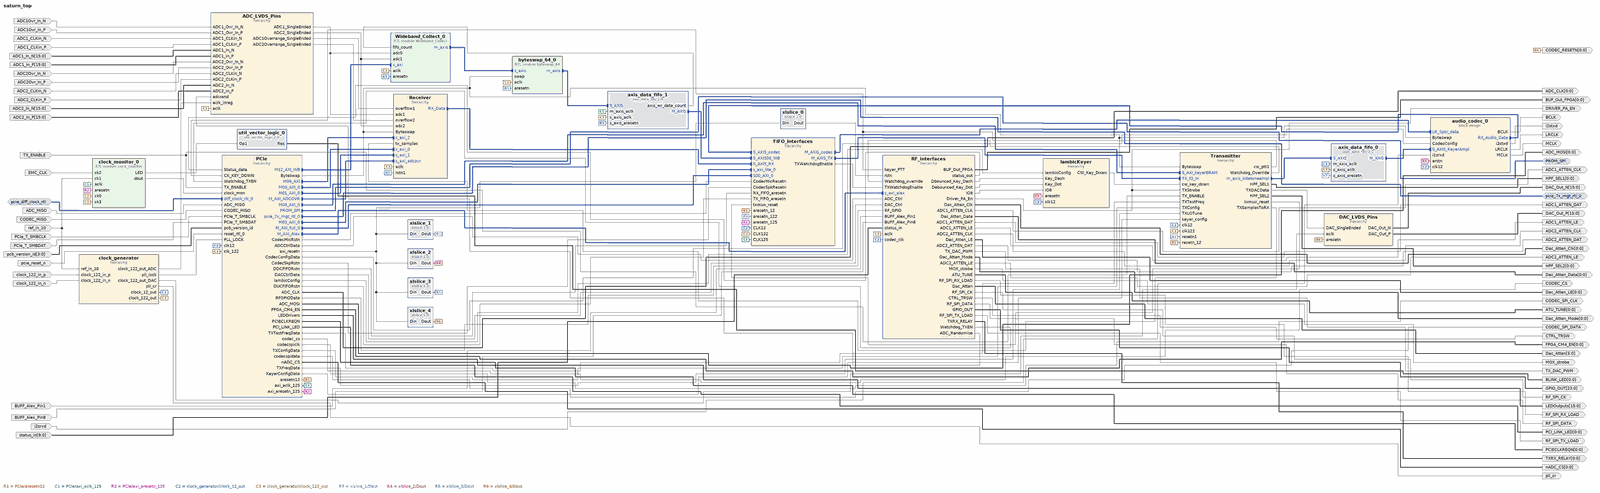
[diagram p0: block diagram of the top level, whole]
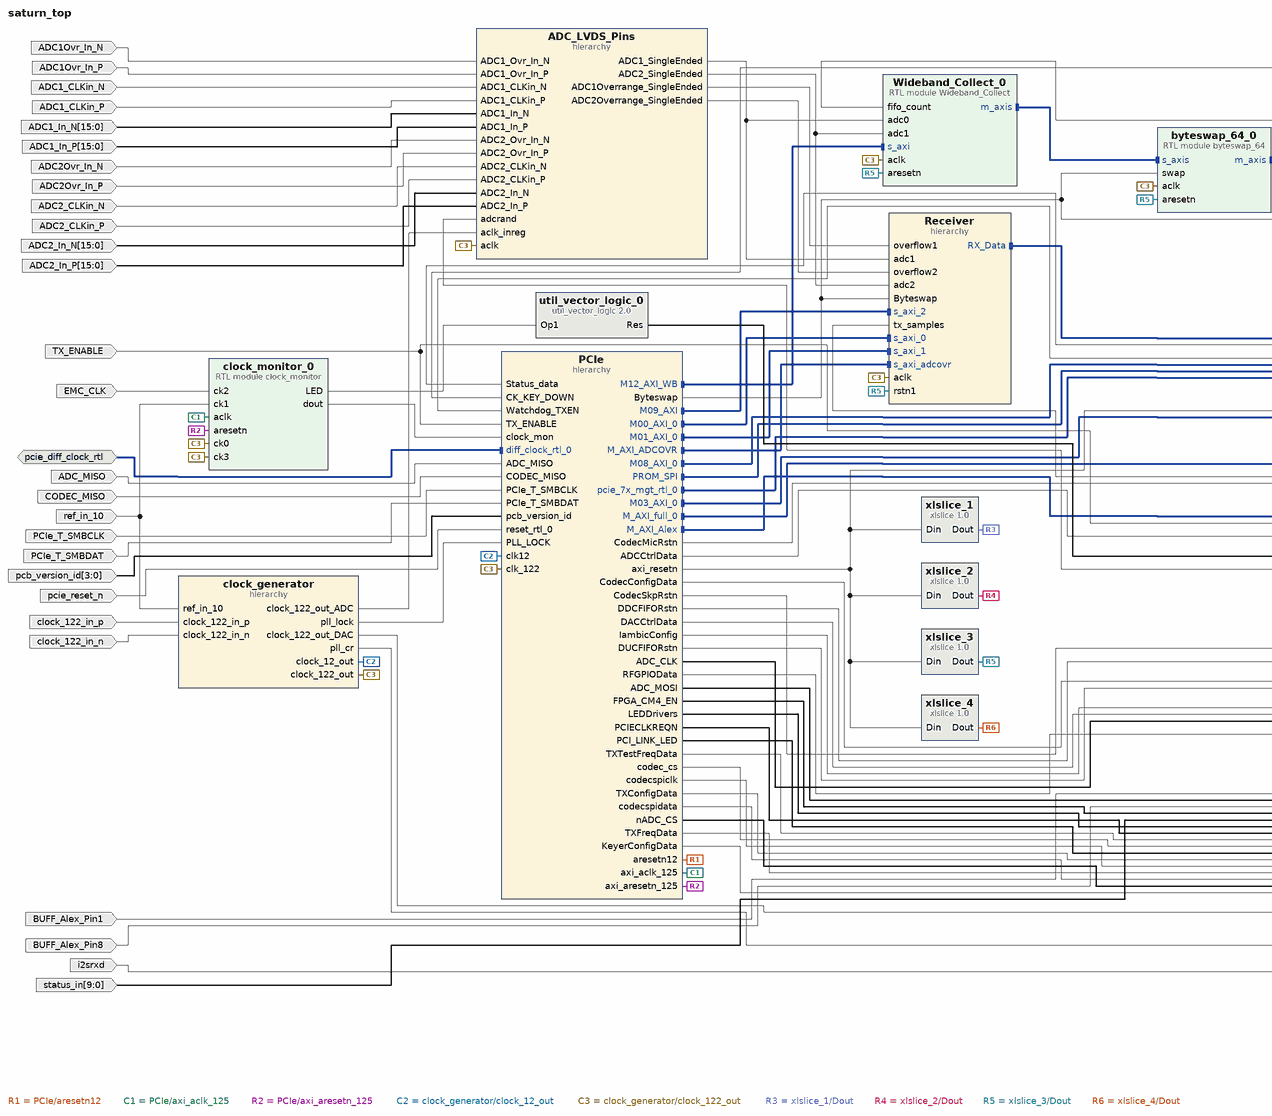
[diagram p1: block diagram of the top level, left part]
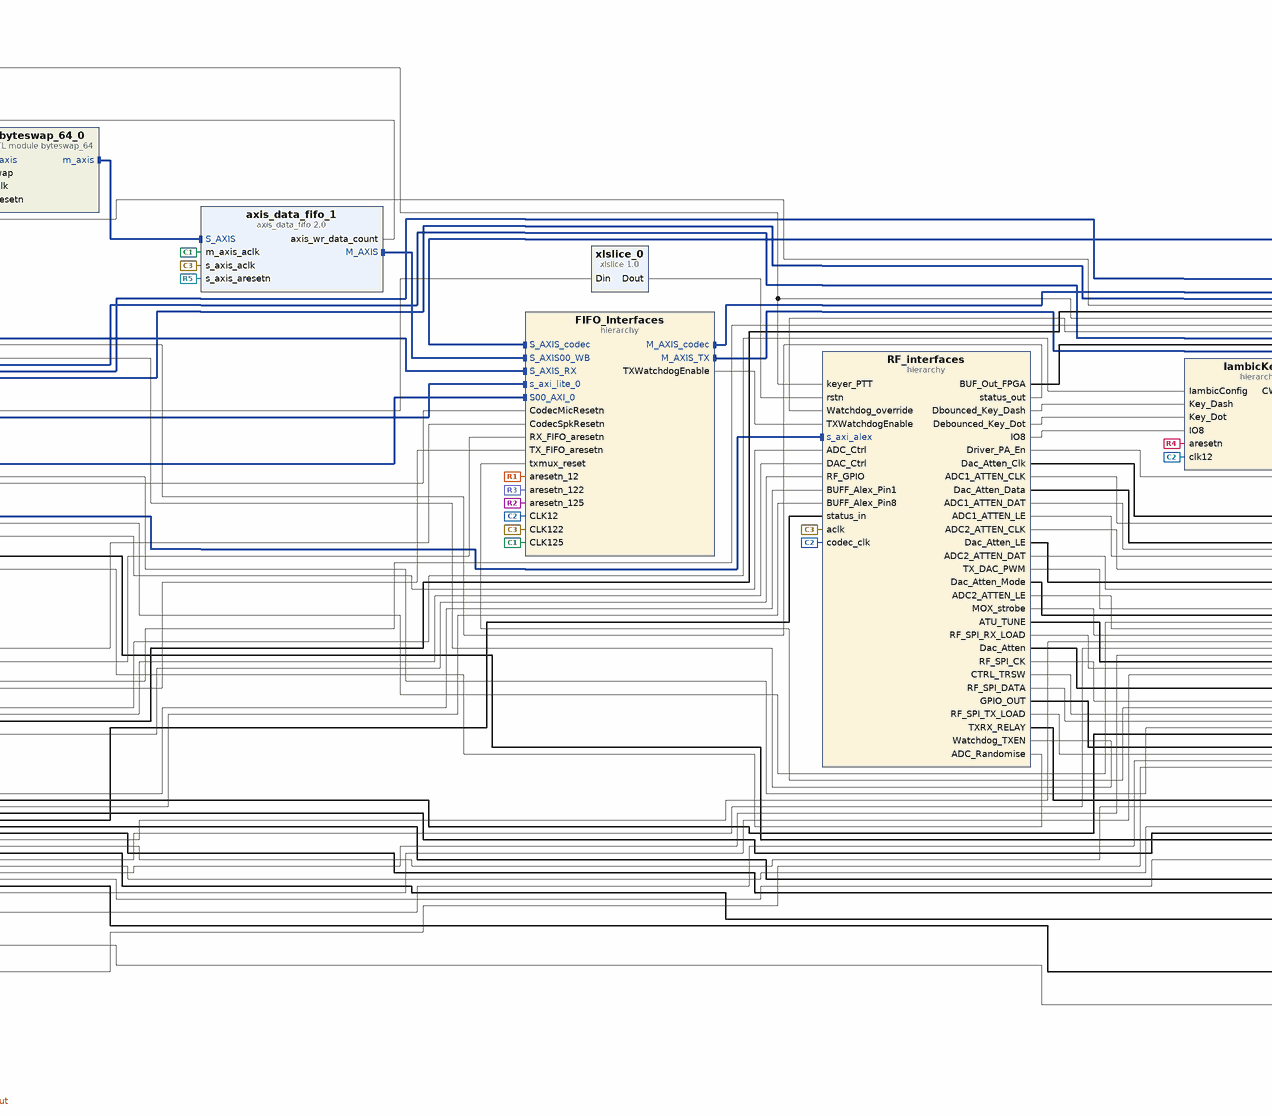
[diagram p2: block diagram of the top level, centre part]
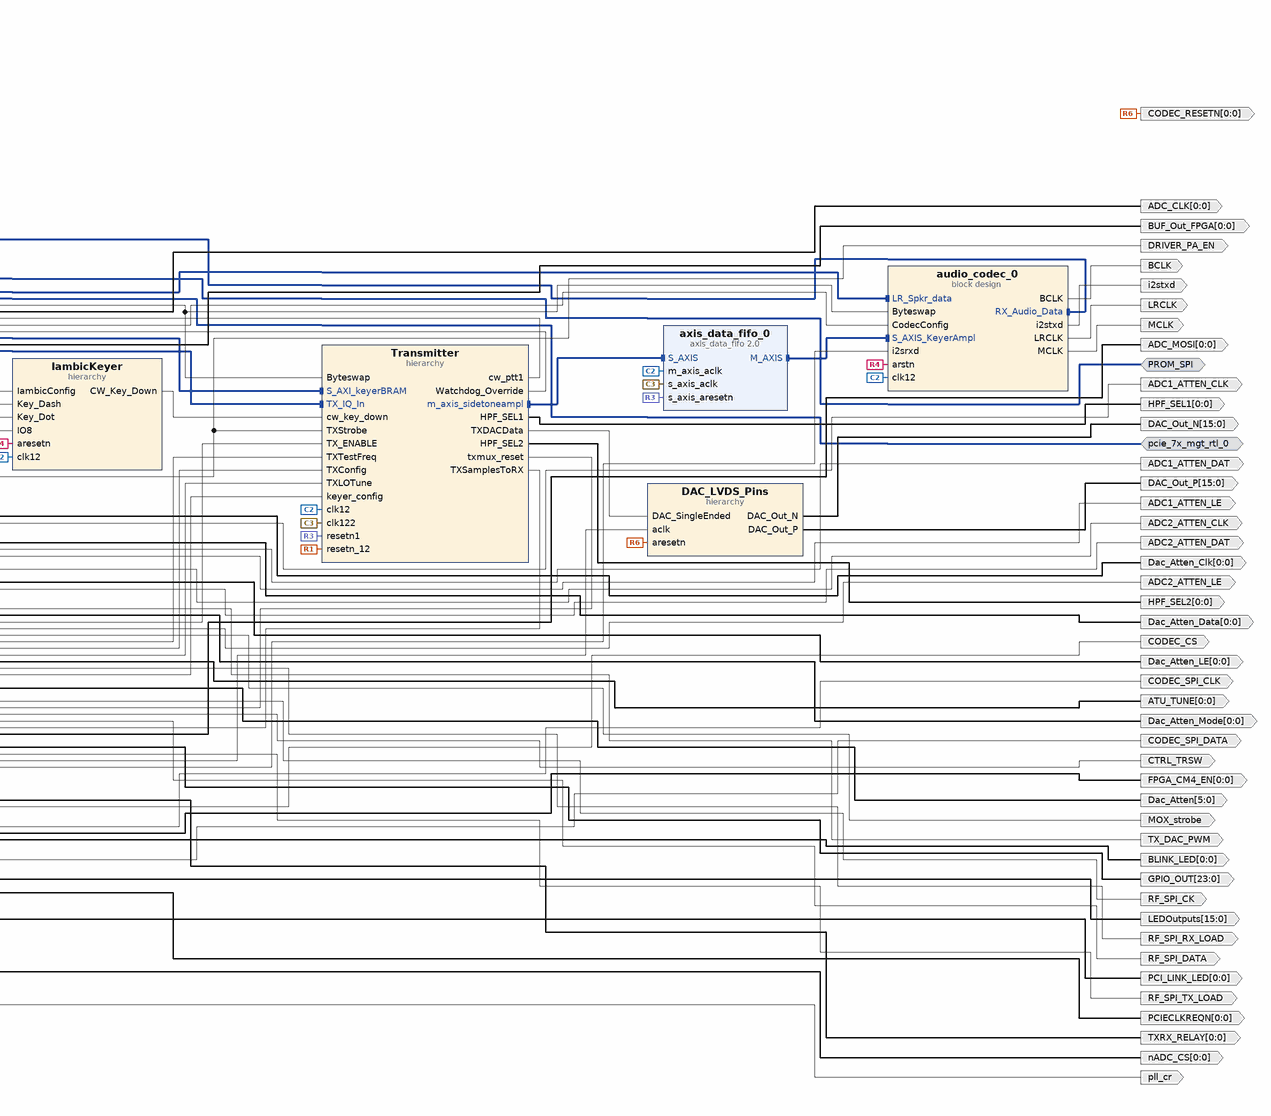
[diagram p3: block diagram of the top level, right part]
# Vivado block design saturn_top, xc7a200tfbg676-2, Vivado 2023.1
create_bd_design saturn_top

create_bd_intf_port -mode Master -vlnv xilinx.com:interface:spi_rtl:1.0 PROM_SPI
create_bd_intf_port -mode Master -vlnv xilinx.com:interface:pcie_7x_mgt_rtl:1.0 pcie_7x_mgt_rtl_0
create_bd_intf_port -mode Slave -vlnv xilinx.com:interface:diff_clock_rtl:1.0 pcie_diff_clock_rtl
set_property -dict {CONFIG.FREQ_HZ 100000000} [get_bd_intf_ports pcie_diff_clock_rtl]
create_bd_port -dir I ADC1Ovr_In_N
create_bd_port -dir I ADC1Ovr_In_P
create_bd_port -dir O ADC1_ATTEN_CLK
create_bd_port -dir O ADC1_ATTEN_DAT
create_bd_port -dir O ADC1_ATTEN_LE
create_bd_port -dir I ADC1_CLKin_N
create_bd_port -dir I ADC1_CLKin_P
create_bd_port -dir I -from 15 -to 0 ADC1_In_N
create_bd_port -dir I -from 15 -to 0 ADC1_In_P
create_bd_port -dir I ADC2Ovr_In_N
create_bd_port -dir I ADC2Ovr_In_P
create_bd_port -dir O ADC2_ATTEN_CLK
create_bd_port -dir O ADC2_ATTEN_DAT
create_bd_port -dir O ADC2_ATTEN_LE
create_bd_port -dir I ADC2_CLKin_N
create_bd_port -dir I ADC2_CLKin_P
create_bd_port -dir I -from 15 -to 0 ADC2_In_N
create_bd_port -dir I -from 15 -to 0 ADC2_In_P
create_bd_port -dir O -from 0 -to 0 ADC_CLK
create_bd_port -dir I ADC_MISO
create_bd_port -dir O -from 0 -to 0 ADC_MOSI
create_bd_port -dir O -from 0 -to 0 ATU_TUNE
create_bd_port -dir O BCLK
create_bd_port -dir O -from 0 -to 0 BLINK_LED
create_bd_port -dir I BUFF_Alex_Pin1
create_bd_port -dir I BUFF_Alex_Pin8
create_bd_port -dir O -from 0 -to 0 BUF_Out_FPGA
create_bd_port -dir O CTRL_TRSW
create_bd_port -dir O -from 15 -to 0 DAC_Out_N
create_bd_port -dir O -from 15 -to 0 DAC_Out_P
create_bd_port -dir O DRIVER_PA_EN
create_bd_port -dir O -from 5 -to 0 Dac_Atten
create_bd_port -dir O -from 0 -to 0 Dac_Atten_Clk
create_bd_port -dir O -from 0 -to 0 Dac_Atten_Data
create_bd_port -dir O -from 0 -to 0 Dac_Atten_LE
create_bd_port -dir O -from 0 -to 0 Dac_Atten_Mode
create_bd_port -dir I -type clk EMC_CLK
set_property -dict {CONFIG.FREQ_HZ 122880000} [get_bd_ports EMC_CLK]
create_bd_port -dir O -from 0 -to 0 FPGA_CM4_EN
create_bd_port -dir O -from 23 -to 0 GPIO_OUT
create_bd_port -dir O -from 15 -to 0 LEDOutputs
create_bd_port -dir O LRCLK
create_bd_port -dir O -type clk MCLK
create_bd_port -dir O MOX_strobe
create_bd_port -dir O -from 0 -to 0 PCIECLKREQN
create_bd_port -dir O -from 0 -to 0 PCI_LINK_LED
create_bd_port -dir I PCIe_T_SMBCLK
create_bd_port -dir I PCIe_T_SMBDAT
create_bd_port -dir O RF_SPI_CK
create_bd_port -dir O RF_SPI_DATA
create_bd_port -dir O RF_SPI_RX_LOAD
create_bd_port -dir O RF_SPI_TX_LOAD
create_bd_port -dir O -from 0 -to 0 TXRX_RELAY
create_bd_port -dir O TX_DAC_PWM
create_bd_port -dir I TX_ENABLE
create_bd_port -dir I clock_122_in_n
create_bd_port -dir I -type clk clock_122_in_p
set_property -dict {CONFIG.FREQ_HZ 122880000} [get_bd_ports clock_122_in_p]
create_bd_port -dir I i2srxd
create_bd_port -dir O i2stxd
create_bd_port -dir O -from 0 -to 0 nADC_CS
create_bd_port -dir I -type rst pcie_reset_n
set_property -dict {CONFIG.POLARITY ACTIVE_LOW} [get_bd_ports pcie_reset_n]
create_bd_port -dir O pll_cr
create_bd_port -dir I -from 9 -to 0 status_in
create_bd_port -dir O CODEC_SPI_DATA
create_bd_port -dir O CODEC_SPI_CLK
create_bd_port -dir O CODEC_CS
create_bd_port -dir I -from 3 -to 0 pcb_version_id
create_bd_port -dir I CODEC_MISO
create_bd_port -dir O -from 0 -to 0 CODEC_RESETN
create_bd_port -dir I -type clk ref_in_10
set_property -dict {CONFIG.FREQ_HZ 10000000} [get_bd_ports ref_in_10]
create_bd_port -dir O -from 0 -to 0 HPF_SEL1
create_bd_port -dir O -from 0 -to 0 HPF_SEL2

create_bd_cell -type hier ADC_LVDS_Pins
create_bd_cell -type hier DAC_LVDS_Pins
create_bd_cell -type hier FIFO_Interfaces
create_bd_cell -type hier PCIe
create_bd_cell -type hier RF_interfaces
create_bd_cell -type hier Receiver
create_bd_cell -type hier Transmitter
create_bd_cell -type container -reference audio_codec audio_codec_0
set_property -dict [list \
  CONFIG.ACTIVE_SIM_BD audio_codec.bd \
  CONFIG.ACTIVE_SYNTH_BD audio_codec.bd \
  CONFIG.ENABLE_DFX 0 \
  CONFIG.LIST_SIM_BD audio_codec.bd \
  CONFIG.LIST_SYNTH_BD audio_codec.bd \
  CONFIG.LOCK_PROPAGATE 0 \
] [get_bd_cells audio_codec_0]
create_bd_cell -type hier clock_generator
create_bd_cell -type ip -vlnv xilinx.com:ip:xlslice:1.0 xlslice_0
set_property -dict {CONFIG.DIN_FROM 4 CONFIG.DIN_TO 4 CONFIG.DIN_WIDTH 5 CONFIG.DOUT_WIDTH 1} [get_bd_cells xlslice_0]
create_bd_cell -type ip -vlnv xilinx.com:ip:xlslice:1.0 xlslice_1
set_property -dict {CONFIG.DIN_FROM 3 CONFIG.DIN_TO 3 CONFIG.DIN_WIDTH 5 CONFIG.DOUT_WIDTH 1} [get_bd_cells xlslice_1]
create_bd_cell -type ip -vlnv xilinx.com:ip:xlslice:1.0 xlslice_2
set_property -dict {CONFIG.DIN_FROM 2 CONFIG.DIN_TO 2 CONFIG.DIN_WIDTH 5 CONFIG.DOUT_WIDTH 1} [get_bd_cells xlslice_2]
create_bd_cell -type ip -vlnv xilinx.com:ip:xlslice:1.0 xlslice_3
set_property -dict {CONFIG.DIN_FROM 1 CONFIG.DIN_TO 1 CONFIG.DIN_WIDTH 5 CONFIG.DOUT_WIDTH 1} [get_bd_cells xlslice_3]
create_bd_cell -type ip -vlnv xilinx.com:ip:xlslice:1.0 xlslice_4
set_property -dict {CONFIG.DIN_FROM 0 CONFIG.DIN_TO 0 CONFIG.DIN_WIDTH 5 CONFIG.DOUT_WIDTH 1} [get_bd_cells xlslice_4]
create_bd_cell -type hier IambicKeyer
create_bd_cell -type ip -vlnv xilinx.com:ip:axis_data_fifo:2.0 axis_data_fifo_0
set_property -dict {CONFIG.FIFO_DEPTH 16 CONFIG.IS_ACLK_ASYNC 1} [get_bd_cells axis_data_fifo_0]
create_bd_cell -type ip -vlnv xilinx.com:ip:util_vector_logic:2.0 util_vector_logic_0
set_property -dict {CONFIG.C_OPERATION not CONFIG.C_SIZE 1} [get_bd_cells util_vector_logic_0]
create_bd_cell -type ip -vlnv xilinx.com:ip:axis_data_fifo:2.0 axis_data_fifo_1
set_property -dict [list \
  CONFIG.FIFO_DEPTH 8192 \
  CONFIG.HAS_WR_DATA_COUNT 1 \
  CONFIG.IS_ACLK_ASYNC 1 \
  CONFIG.TDATA_NUM_BYTES 8 \
] [get_bd_cells axis_data_fifo_1]
create_bd_cell -type module -reference clock_monitor clock_monitor_0
create_bd_cell -type module -reference byteswap_64 byteswap_64_0
create_bd_cell -type module -reference Wideband_Collect Wideband_Collect_0

# ---- hierarchy /ADC_LVDS_Pins ----
current_bd_instance /ADC_LVDS_Pins
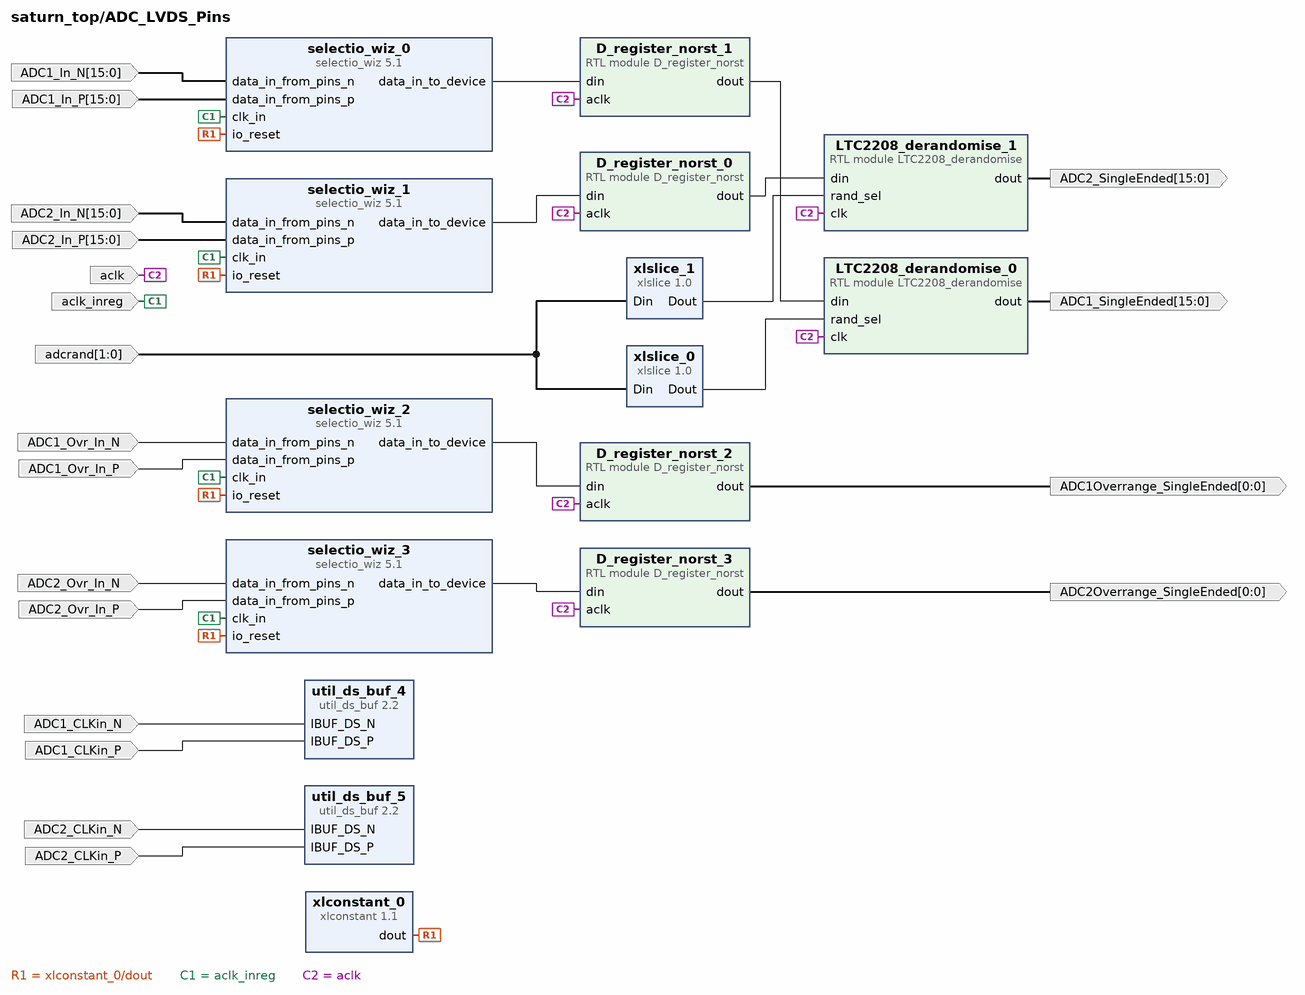
[diagram p4: block diagram inside /ADC_LVDS_Pins]
create_bd_pin -dir O -from 0 -to 0 ADC1Overrange_SingleEnded
create_bd_pin -dir I ADC1_CLKin_N
create_bd_pin -dir I ADC1_CLKin_P
create_bd_pin -dir I -from 15 -to 0 ADC1_In_N
create_bd_pin -dir I -from 15 -to 0 ADC1_In_P
create_bd_pin -dir I ADC1_Ovr_In_N
create_bd_pin -dir I ADC1_Ovr_In_P
create_bd_pin -dir O -from 15 -to 0 ADC1_SingleEnded
create_bd_pin -dir O -from 0 -to 0 ADC2Overrange_SingleEnded
create_bd_pin -dir I ADC2_CLKin_N
create_bd_pin -dir I ADC2_CLKin_P
create_bd_pin -dir I -from 15 -to 0 ADC2_In_N
create_bd_pin -dir I -from 15 -to 0 ADC2_In_P
create_bd_pin -dir I ADC2_Ovr_In_N
create_bd_pin -dir I ADC2_Ovr_In_P
create_bd_pin -dir O -from 15 -to 0 ADC2_SingleEnded
create_bd_pin -dir I aclk_inreg
create_bd_pin -dir I -from 1 -to 0 adcrand
create_bd_pin -dir I aclk

create_bd_cell -type ip -vlnv xilinx.com:ip:xlslice:1.0 xlslice_0
set_property -dict {CONFIG.DIN_FROM 0 CONFIG.DIN_TO 0 CONFIG.DIN_WIDTH 2} [get_bd_cells xlslice_0]
create_bd_cell -type ip -vlnv xilinx.com:ip:xlslice:1.0 xlslice_1
set_property -dict {CONFIG.DIN_FROM 1 CONFIG.DIN_TO 1 CONFIG.DIN_WIDTH 2 CONFIG.DOUT_WIDTH 1} [get_bd_cells xlslice_1]
create_bd_cell -type module -reference D_register_norst D_register_norst_1
create_bd_cell -type module -reference D_register_norst D_register_norst_2
set_property -dict {CONFIG.DATA_WIDTH 1} [get_bd_cells D_register_norst_2]
create_bd_cell -type module -reference D_register_norst D_register_norst_3
set_property -dict {CONFIG.DATA_WIDTH 1} [get_bd_cells D_register_norst_3]
create_bd_cell -type ip -vlnv xilinx.com:ip:selectio_wiz:5.1 selectio_wiz_0
set_property -dict [list \
  CONFIG.BUS_IO_STD LVDS_25 \
  CONFIG.BUS_SIG_TYPE DIFF \
  CONFIG.CLK_FWD_IO_STD LVDS_25 \
  CONFIG.CLK_FWD_SIG_TYPE DIFF \
  CONFIG.SELIO_CLK_BUF MMCM \
  CONFIG.SELIO_CLK_IO_STD LVDS_25 \
  CONFIG.SELIO_CLK_SIG_TYPE DIFF \
  CONFIG.SERIALIZATION_FACTOR 4 \
  CONFIG.SYSTEM_DATA_WIDTH 16 \
] [get_bd_cells selectio_wiz_0]
create_bd_cell -type ip -vlnv xilinx.com:ip:selectio_wiz:5.1 selectio_wiz_1
set_property -dict [list \
  CONFIG.BUS_IO_STD LVDS_25 \
  CONFIG.BUS_SIG_TYPE DIFF \
  CONFIG.CLK_FWD_IO_STD LVDS_25 \
  CONFIG.CLK_FWD_SIG_TYPE DIFF \
  CONFIG.SELIO_CLK_BUF MMCM \
  CONFIG.SELIO_CLK_IO_STD LVDS_25 \
  CONFIG.SELIO_CLK_SIG_TYPE DIFF \
  CONFIG.SERIALIZATION_FACTOR 4 \
  CONFIG.SYSTEM_DATA_WIDTH 16 \
] [get_bd_cells selectio_wiz_1]
create_bd_cell -type ip -vlnv xilinx.com:ip:selectio_wiz:5.1 selectio_wiz_2
set_property -dict [list \
  CONFIG.BUS_IO_STD LVDS_25 \
  CONFIG.BUS_SIG_TYPE DIFF \
  CONFIG.CLK_FWD_IO_STD LVDS_25 \
  CONFIG.CLK_FWD_SIG_TYPE DIFF \
  CONFIG.SELIO_CLK_BUF MMCM \
  CONFIG.SELIO_CLK_IO_STD LVDS_25 \
  CONFIG.SELIO_CLK_SIG_TYPE DIFF \
  CONFIG.SERIALIZATION_FACTOR 4 \
  CONFIG.SYSTEM_DATA_WIDTH 1 \
] [get_bd_cells selectio_wiz_2]
create_bd_cell -type ip -vlnv xilinx.com:ip:selectio_wiz:5.1 selectio_wiz_3
set_property -dict [list \
  CONFIG.BUS_IO_STD LVDS_25 \
  CONFIG.BUS_SIG_TYPE DIFF \
  CONFIG.CLK_FWD_IO_STD LVDS_25 \
  CONFIG.CLK_FWD_SIG_TYPE DIFF \
  CONFIG.SELIO_CLK_BUF MMCM \
  CONFIG.SELIO_CLK_IO_STD LVDS_25 \
  CONFIG.SELIO_CLK_SIG_TYPE DIFF \
  CONFIG.SERIALIZATION_FACTOR 4 \
  CONFIG.SYSTEM_DATA_WIDTH 1 \
] [get_bd_cells selectio_wiz_3]
create_bd_cell -type ip -vlnv xilinx.com:ip:util_ds_buf:2.2 util_ds_buf_4
set_property -dict {CONFIG.C_BUF_TYPE IBUFDS} [get_bd_cells util_ds_buf_4]
create_bd_cell -type ip -vlnv xilinx.com:ip:util_ds_buf:2.2 util_ds_buf_5
set_property -dict {CONFIG.C_BUF_TYPE IBUFDS} [get_bd_cells util_ds_buf_5]
create_bd_cell -type ip -vlnv xilinx.com:ip:xlconstant:1.1 xlconstant_0
set_property -dict {CONFIG.CONST_VAL 0} [get_bd_cells xlconstant_0]
create_bd_cell -type module -reference LTC2208_derandomise LTC2208_derandomise_1
create_bd_cell -type module -reference D_register_norst D_register_norst_0
create_bd_cell -type module -reference LTC2208_derandomise LTC2208_derandomise_0

# ---- hierarchy /DAC_LVDS_Pins ----
current_bd_instance /DAC_LVDS_Pins
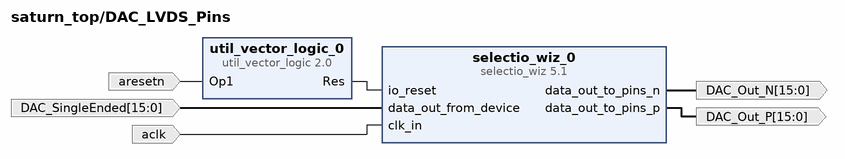
[diagram p5: block diagram inside /DAC_LVDS_Pins]
create_bd_pin -dir O -from 15 -to 0 DAC_Out_N
create_bd_pin -dir O -from 15 -to 0 DAC_Out_P
create_bd_pin -dir I -from 15 -to 0 DAC_SingleEnded
create_bd_pin -dir I aresetn
create_bd_pin -dir I aclk

create_bd_cell -type ip -vlnv xilinx.com:ip:selectio_wiz:5.1 selectio_wiz_0
set_property -dict [list \
  CONFIG.BUS_DIR OUTPUTS \
  CONFIG.BUS_IO_STD LVDS_25 \
  CONFIG.BUS_SIG_TYPE DIFF \
  CONFIG.CLK_FWD_IO_STD LVDS_25 \
  CONFIG.CLK_FWD_SIG_TYPE DIFF \
  CONFIG.SELIO_BUS_IN_DELAY NONE \
  CONFIG.SELIO_CLK_BUF MMCM \
  CONFIG.SELIO_CLK_IO_STD LVDS_25 \
  CONFIG.SELIO_CLK_SIG_TYPE DIFF \
  CONFIG.SELIO_INTERFACE_TYPE NETWORKING \
  CONFIG.SERIALIZATION_FACTOR 4 \
  CONFIG.SYSTEM_DATA_WIDTH 16 \
] [get_bd_cells selectio_wiz_0]
create_bd_cell -type ip -vlnv xilinx.com:ip:util_vector_logic:2.0 util_vector_logic_0
set_property -dict {CONFIG.C_OPERATION not CONFIG.C_SIZE 1} [get_bd_cells util_vector_logic_0]

# ---- hierarchy /FIFO_Interfaces ----
current_bd_instance /FIFO_Interfaces
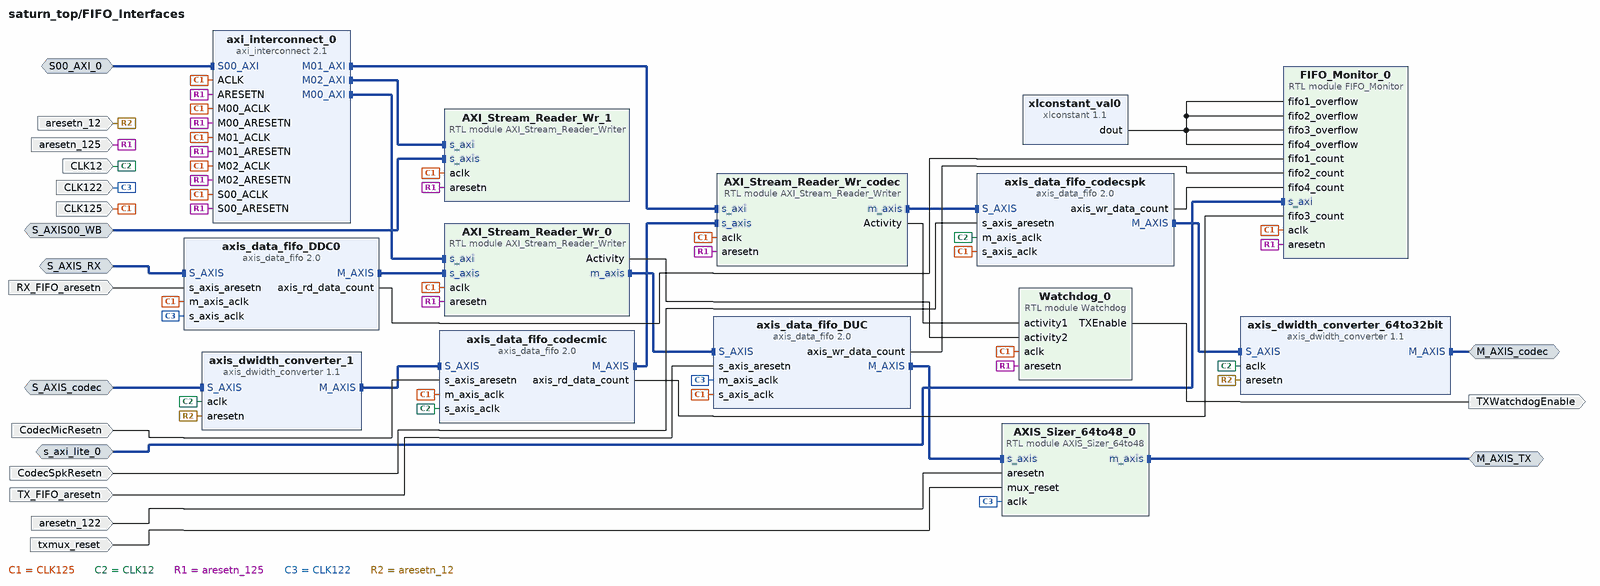
[diagram p6: block diagram inside /FIFO_Interfaces]
create_bd_intf_pin -mode Master -vlnv xilinx.com:interface:axis_rtl:1.0 M_AXIS_TX
create_bd_intf_pin -mode Master -vlnv xilinx.com:interface:axis_rtl:1.0 M_AXIS_codec
create_bd_intf_pin -mode Slave -vlnv xilinx.com:interface:aximm_rtl:1.0 S00_AXI_0
create_bd_intf_pin -mode Slave -vlnv xilinx.com:interface:axis_rtl:1.0 S_AXIS_RX
create_bd_intf_pin -mode Slave -vlnv xilinx.com:interface:axis_rtl:1.0 S_AXIS_codec
create_bd_intf_pin -mode Slave -vlnv xilinx.com:interface:aximm_rtl:1.0 s_axi_lite_0
create_bd_intf_pin -mode Slave -vlnv xilinx.com:interface:axis_rtl:1.0 S_AXIS00_WB
create_bd_pin -dir I CLK12
create_bd_pin -dir I CLK122
create_bd_pin -dir I CLK125
create_bd_pin -dir I aresetn_12
create_bd_pin -dir I aresetn_125
create_bd_pin -dir I TX_FIFO_aresetn
create_bd_pin -dir I RX_FIFO_aresetn
create_bd_pin -dir I CodecMicResetn
create_bd_pin -dir I CodecSpkResetn
create_bd_pin -dir I aresetn_122
create_bd_pin -dir I txmux_reset
create_bd_pin -dir O TXWatchdogEnable

create_bd_cell -type ip -vlnv xilinx.com:ip:axi_interconnect:2.1 axi_interconnect_0
set_property -dict {CONFIG.NUM_MI 3} [get_bd_cells axi_interconnect_0]
create_bd_cell -type ip -vlnv xilinx.com:ip:axis_data_fifo:2.0 axis_data_fifo_DDC0
set_property -dict [list \
  CONFIG.FIFO_DEPTH 16384 \
  CONFIG.HAS_AFULL 0 \
  CONFIG.HAS_RD_DATA_COUNT 1 \
  CONFIG.HAS_WR_DATA_COUNT 0 \
  CONFIG.IS_ACLK_ASYNC 1 \
  CONFIG.TDATA_NUM_BYTES 8 \
] [get_bd_cells axis_data_fifo_DDC0]
create_bd_cell -type ip -vlnv xilinx.com:ip:axis_data_fifo:2.0 axis_data_fifo_DUC
set_property -dict [list \
  CONFIG.FIFO_DEPTH 4096 \
  CONFIG.HAS_WR_DATA_COUNT 1 \
  CONFIG.IS_ACLK_ASYNC 1 \
  CONFIG.TDATA_NUM_BYTES 8 \
] [get_bd_cells axis_data_fifo_DUC]
create_bd_cell -type ip -vlnv xilinx.com:ip:axis_data_fifo:2.0 axis_data_fifo_codecmic
set_property -dict [list \
  CONFIG.FIFO_DEPTH 256 \
  CONFIG.HAS_RD_DATA_COUNT 1 \
  CONFIG.IS_ACLK_ASYNC 1 \
  CONFIG.TDATA_NUM_BYTES 8 \
] [get_bd_cells axis_data_fifo_codecmic]
create_bd_cell -type ip -vlnv xilinx.com:ip:axis_data_fifo:2.0 axis_data_fifo_codecspk
set_property -dict [list \
  CONFIG.FIFO_DEPTH 1024 \
  CONFIG.HAS_WR_DATA_COUNT 1 \
  CONFIG.IS_ACLK_ASYNC 1 \
  CONFIG.TDATA_NUM_BYTES 8 \
] [get_bd_cells axis_data_fifo_codecspk]
create_bd_cell -type ip -vlnv xilinx.com:ip:axis_dwidth_converter:1.1 axis_dwidth_converter_1
set_property -dict {CONFIG.M_TDATA_NUM_BYTES 8 CONFIG.S_TDATA_NUM_BYTES 2} [get_bd_cells axis_dwidth_converter_1]
create_bd_cell -type ip -vlnv xilinx.com:ip:axis_dwidth_converter:1.1 axis_dwidth_converter_64to32bit
set_property -dict {CONFIG.M_TDATA_NUM_BYTES 4 CONFIG.S_TDATA_NUM_BYTES 8} [get_bd_cells axis_dwidth_converter_64to32bit]
create_bd_cell -type ip -vlnv xilinx.com:ip:xlconstant:1.1 xlconstant_val0
set_property -dict {CONFIG.CONST_VAL 0} [get_bd_cells xlconstant_val0]
create_bd_cell -type module -reference AXI_Stream_Reader_Writer AXI_Stream_Reader_Wr_1
set_property -dict {CONFIG.AXI_DATA_WIDTH 64} [get_bd_cells AXI_Stream_Reader_Wr_1]
create_bd_cell -type module -reference AXI_Stream_Reader_Writer AXI_Stream_Reader_Wr_codec
set_property -dict {CONFIG.AXI_DATA_WIDTH 64} [get_bd_cells AXI_Stream_Reader_Wr_codec]
create_bd_cell -type module -reference AXIS_Sizer_64to48 AXIS_Sizer_64to48_0
create_bd_cell -type module -reference FIFO_Monitor FIFO_Monitor_0
create_bd_cell -type module -reference AXI_Stream_Reader_Writer AXI_Stream_Reader_Wr_0
set_property -dict {CONFIG.AXI_DATA_WIDTH 64} [get_bd_cells AXI_Stream_Reader_Wr_0]
create_bd_cell -type module -reference Watchdog Watchdog_0
set_property -dict {CONFIG.TimeoutClocks 245760000} [get_bd_cells Watchdog_0]

# ---- hierarchy /PCIe ----
current_bd_instance /PCIe
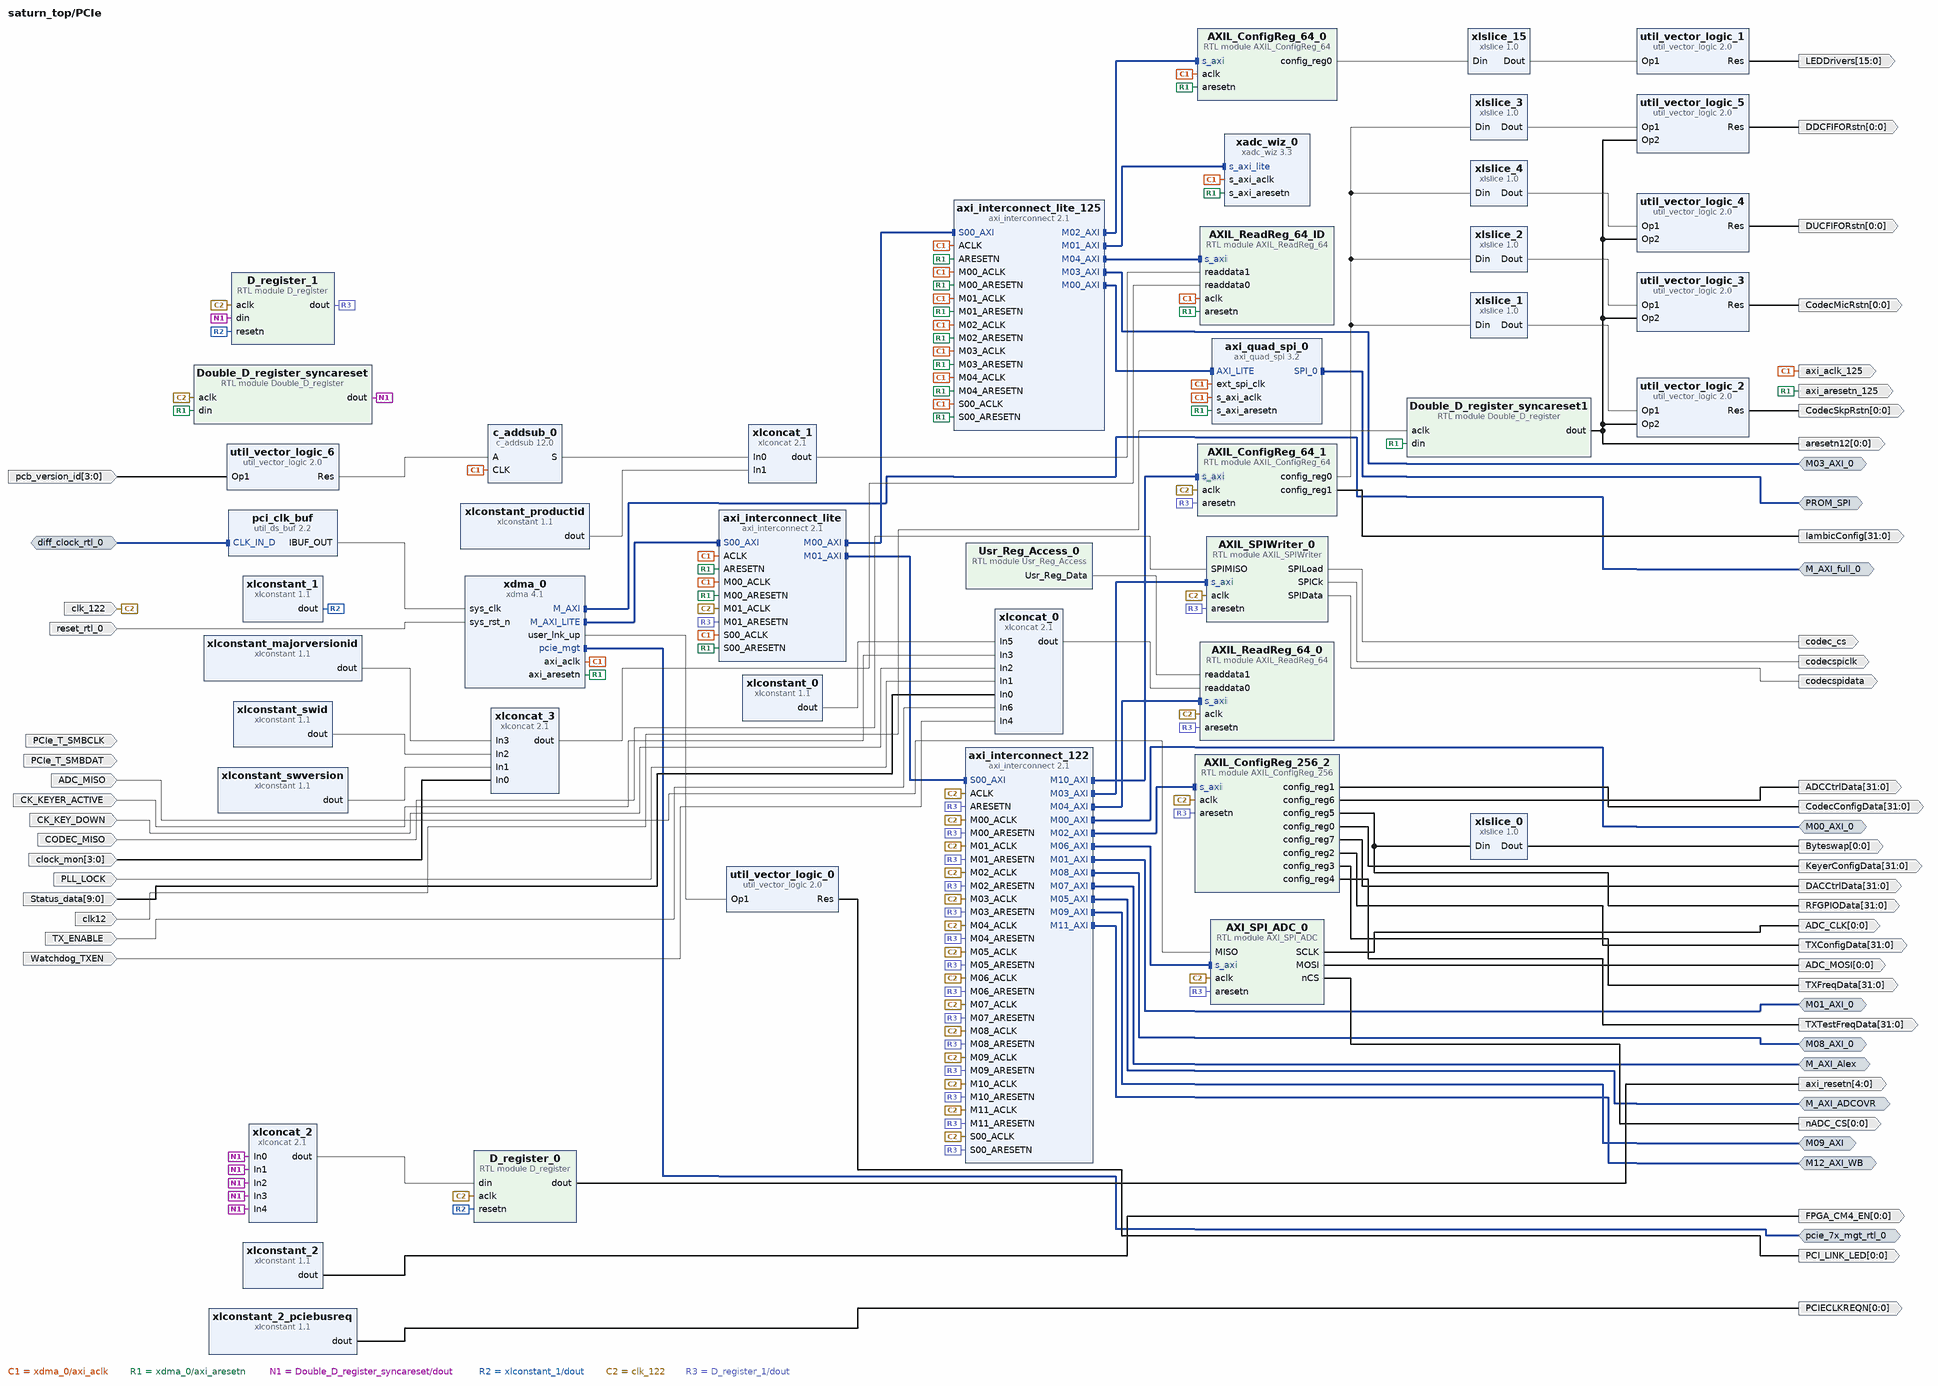
[diagram p7: block diagram inside /PCIe]
create_bd_intf_pin -mode Master -vlnv xilinx.com:interface:aximm_rtl:1.0 M00_AXI_0
create_bd_intf_pin -mode Master -vlnv xilinx.com:interface:aximm_rtl:1.0 M01_AXI_0
create_bd_intf_pin -mode Master -vlnv xilinx.com:interface:aximm_rtl:1.0 M03_AXI_0
create_bd_intf_pin -mode Master -vlnv xilinx.com:interface:aximm_rtl:1.0 M08_AXI_0
create_bd_intf_pin -mode Master -vlnv xilinx.com:interface:aximm_rtl:1.0 M_AXI_Alex
create_bd_intf_pin -mode Master -vlnv xilinx.com:interface:aximm_rtl:1.0 M_AXI_full_0
create_bd_intf_pin -mode Master -vlnv xilinx.com:interface:spi_rtl:1.0 PROM_SPI
create_bd_intf_pin -mode Slave -vlnv xilinx.com:interface:diff_clock_rtl:1.0 diff_clock_rtl_0
create_bd_intf_pin -mode Master -vlnv xilinx.com:interface:pcie_7x_mgt_rtl:1.0 pcie_7x_mgt_rtl_0
create_bd_intf_pin -mode Master -vlnv xilinx.com:interface:aximm_rtl:1.0 M09_AXI
create_bd_intf_pin -mode Master -vlnv xilinx.com:interface:aximm_rtl:1.0 M12_AXI_WB
create_bd_intf_pin -mode Master -vlnv xilinx.com:interface:aximm_rtl:1.0 M_AXI_ADCOVR
create_bd_pin -dir O -from 31 -to 0 ADCCtrlData
create_bd_pin -dir O -from 0 -to 0 ADC_CLK
create_bd_pin -dir I ADC_MISO
create_bd_pin -dir O -from 0 -to 0 ADC_MOSI
create_bd_pin -dir O -from 31 -to 0 CodecConfigData
create_bd_pin -dir O -from 31 -to 0 DACCtrlData
create_bd_pin -dir O -from 0 -to 0 FPGA_CM4_EN
create_bd_pin -dir O -from 31 -to 0 KeyerConfigData
create_bd_pin -dir O -from 15 -to 0 LEDDrivers
create_bd_pin -dir O -from 0 -to 0 PCIECLKREQN
create_bd_pin -dir O -from 0 -to 0 PCI_LINK_LED
create_bd_pin -dir I PCIe_T_SMBCLK
create_bd_pin -dir I PCIe_T_SMBDAT
create_bd_pin -dir O -from 31 -to 0 RFGPIOData
create_bd_pin -dir I -from 9 -to 0 Status_data
create_bd_pin -dir O -from 31 -to 0 TXConfigData
create_bd_pin -dir O -from 31 -to 0 TXFreqData
create_bd_pin -dir O -from 31 -to 0 TXTestFreqData
create_bd_pin -dir I TX_ENABLE
create_bd_pin -dir O -from 0 -to 0 aresetn12
create_bd_pin -dir O axi_aclk_125
create_bd_pin -dir O axi_aresetn_125
create_bd_pin -dir O -from 4 -to 0 axi_resetn
create_bd_pin -dir I clk12
create_bd_pin -dir I clk_122
create_bd_pin -dir O -from 0 -to 0 nADC_CS
create_bd_pin -dir I -type rst reset_rtl_0
create_bd_pin -dir I PLL_LOCK
create_bd_pin -dir I -from 3 -to 0 clock_mon
create_bd_pin -dir O codecspiclk
create_bd_pin -dir O codecspidata
create_bd_pin -dir O -from 0 -to 0 Byteswap
create_bd_pin -dir O codec_cs
create_bd_pin -dir O -from 0 -to 0 CodecMicRstn
create_bd_pin -dir O -from 0 -to 0 CodecSkpRstn
create_bd_pin -dir O -from 0 -to 0 DDCFIFORstn
create_bd_pin -dir O -from 0 -to 0 DUCFIFORstn
create_bd_pin -dir O -from 31 -to 0 IambicConfig
create_bd_pin -dir I CK_KEY_DOWN
create_bd_pin -dir I -from 3 -to 0 pcb_version_id
create_bd_pin -dir I CK_KEYER_ACTIVE
create_bd_pin -dir I Watchdog_TXEN
create_bd_pin -dir I CODEC_MISO

create_bd_cell -type ip -vlnv xilinx.com:ip:xadc_wiz:3.3 xadc_wiz_0
set_property -dict [list \
  CONFIG.ADC_CONVERSION_RATE 1000 \
  CONFIG.ADC_OFFSET_AND_GAIN_CALIBRATION true \
  CONFIG.CHANNEL_ENABLE_TEMPERATURE true \
  CONFIG.CHANNEL_ENABLE_VAUXP12_VAUXN12 false \
  CONFIG.CHANNEL_ENABLE_VAUXP13_VAUXN13 false \
  CONFIG.CHANNEL_ENABLE_VAUXP5_VAUXN5 false \
  CONFIG.CHANNEL_ENABLE_VAUXP6_VAUXN6 false \
  CONFIG.CHANNEL_ENABLE_VAUXP7_VAUXN7 false \
  CONFIG.CHANNEL_ENABLE_VBRAM true \
  CONFIG.CHANNEL_ENABLE_VCCAUX true \
  CONFIG.CHANNEL_ENABLE_VCCINT true \
  CONFIG.CHANNEL_ENABLE_VP_VN false \
  CONFIG.DCLK_FREQUENCY 125 \
  CONFIG.ENABLE_RESET false \
  CONFIG.EXTERNAL_MUX_CHANNEL VP_VN \
  CONFIG.INTERFACE_SELECTION Enable_AXI \
  CONFIG.OT_ALARM false \
  CONFIG.SEQUENCER_MODE Continuous \
  CONFIG.SINGLE_CHANNEL_SELECTION TEMPERATURE \
  CONFIG.USER_TEMP_ALARM false \
  CONFIG.VCCAUX_ALARM false \
  CONFIG.VCCINT_ALARM false \
  CONFIG.XADC_STARUP_SELECTION channel_sequencer \
] [get_bd_cells xadc_wiz_0]
create_bd_cell -type ip -vlnv xilinx.com:ip:xlconcat:2.1 xlconcat_0
set_property -dict [list \
  CONFIG.IN0_WIDTH 10 \
  CONFIG.IN1_WIDTH 1 \
  CONFIG.IN2_WIDTH 1 \
  CONFIG.IN3_WIDTH 1 \
  CONFIG.IN4_WIDTH 1 \
  CONFIG.IN5_WIDTH 17 \
  CONFIG.IN6_WIDTH 1 \
  CONFIG.NUM_PORTS 7 \
] [get_bd_cells xlconcat_0]
create_bd_cell -type ip -vlnv xilinx.com:ip:xlconcat:2.1 xlconcat_2
set_property -dict {CONFIG.NUM_PORTS 5} [get_bd_cells xlconcat_2]
create_bd_cell -type ip -vlnv xilinx.com:ip:xlslice:1.0 xlslice_15
set_property -dict {CONFIG.DIN_FROM 15 CONFIG.DIN_TO 0 CONFIG.DIN_WIDTH 32 CONFIG.DOUT_WIDTH 16} [get_bd_cells xlslice_15]
create_bd_cell -type ip -vlnv xilinx.com:ip:xlconcat:2.1 xlconcat_1
set_property -dict {CONFIG.IN0_WIDTH 16 CONFIG.IN1_WIDTH 16} [get_bd_cells xlconcat_1]
create_bd_cell -type ip -vlnv xilinx.com:ip:xlconcat:2.1 xlconcat_3
set_property -dict [list \
  CONFIG.IN0_WIDTH 4 \
  CONFIG.IN1_WIDTH 16 \
  CONFIG.IN2_WIDTH 5 \
  CONFIG.IN3_WIDTH 7 \
  CONFIG.NUM_PORTS 4 \
] [get_bd_cells xlconcat_3]
create_bd_cell -type module -reference Double_D_register Double_D_register_syncareset
set_property -dict {CONFIG.DATA_WIDTH 1} [get_bd_cells Double_D_register_syncareset]
create_bd_cell -type module -reference AXIL_ReadReg_64 AXIL_ReadReg_64_ID
create_bd_cell -type ip -vlnv xilinx.com:ip:xlslice:1.0 xlslice_0
set_property -dict {CONFIG.DIN_FROM 26 CONFIG.DIN_TO 26} [get_bd_cells xlslice_0]
create_bd_cell -type module -reference AXIL_ConfigReg_64 AXIL_ConfigReg_64_1
create_bd_cell -type ip -vlnv xilinx.com:ip:xlslice:1.0 xlslice_1
set_property -dict {CONFIG.DIN_FROM 1 CONFIG.DIN_TO 1 CONFIG.DOUT_WIDTH 1} [get_bd_cells xlslice_1]
create_bd_cell -type ip -vlnv xilinx.com:ip:xlslice:1.0 xlslice_2
set_property -dict {CONFIG.DIN_FROM 0 CONFIG.DIN_TO 0 CONFIG.DOUT_WIDTH 1} [get_bd_cells xlslice_2]
create_bd_cell -type ip -vlnv xilinx.com:ip:xlslice:1.0 xlslice_3
set_property -dict {CONFIG.DIN_FROM 2 CONFIG.DIN_TO 2 CONFIG.DOUT_WIDTH 1} [get_bd_cells xlslice_3]
create_bd_cell -type ip -vlnv xilinx.com:ip:xlslice:1.0 xlslice_4
set_property -dict {CONFIG.DIN_FROM 3 CONFIG.DIN_TO 3 CONFIG.DOUT_WIDTH 1} [get_bd_cells xlslice_4]
create_bd_cell -type ip -vlnv xilinx.com:ip:axi_interconnect:2.1 axi_interconnect_122
set_property -dict {CONFIG.ENABLE_ADVANCED_OPTIONS 0 CONFIG.NUM_MI 12} [get_bd_cells axi_interconnect_122]
create_bd_cell -type ip -vlnv xilinx.com:ip:axi_interconnect:2.1 axi_interconnect_lite
set_property -dict {CONFIG.M01_HAS_DATA_FIFO 1 CONFIG.M01_HAS_REGSLICE 3} [get_bd_cells axi_interconnect_lite]
create_bd_cell -type ip -vlnv xilinx.com:ip:axi_interconnect:2.1 axi_interconnect_lite_125
set_property -dict {CONFIG.NUM_MI 5} [get_bd_cells axi_interconnect_lite_125]
create_bd_cell -type ip -vlnv xilinx.com:ip:axi_quad_spi:3.2 axi_quad_spi_0
set_property -dict [list \
  CONFIG.C_FIFO_DEPTH 256 \
  CONFIG.C_SHARED_STARTUP 0 \
  CONFIG.C_SPI_MEMORY 3 \
  CONFIG.C_SPI_MODE 2 \
  CONFIG.C_TYPE_OF_AXI4_INTERFACE 0 \
  CONFIG.C_USE_STARTUP 1 \
  CONFIG.C_XIP_MODE 0 \
] [get_bd_cells axi_quad_spi_0]
create_bd_cell -type ip -vlnv xilinx.com:ip:util_ds_buf:2.2 pci_clk_buf
set_property -dict {CONFIG.C_BUF_TYPE IBUFDSGTE} [get_bd_cells pci_clk_buf]
create_bd_cell -type ip -vlnv xilinx.com:ip:util_vector_logic:2.0 util_vector_logic_0
set_property -dict {CONFIG.C_OPERATION not CONFIG.C_SIZE 1} [get_bd_cells util_vector_logic_0]
create_bd_cell -type ip -vlnv xilinx.com:ip:util_vector_logic:2.0 util_vector_logic_2
set_property -dict {CONFIG.C_SIZE 1} [get_bd_cells util_vector_logic_2]
create_bd_cell -type ip -vlnv xilinx.com:ip:util_vector_logic:2.0 util_vector_logic_1
set_property -dict {CONFIG.C_OPERATION not CONFIG.C_SIZE 16} [get_bd_cells util_vector_logic_1]
create_bd_cell -type ip -vlnv xilinx.com:ip:util_vector_logic:2.0 util_vector_logic_3
set_property -dict {CONFIG.C_SIZE 1} [get_bd_cells util_vector_logic_3]
create_bd_cell -type ip -vlnv xilinx.com:ip:util_vector_logic:2.0 util_vector_logic_4
set_property -dict {CONFIG.C_SIZE 1} [get_bd_cells util_vector_logic_4]
create_bd_cell -type ip -vlnv xilinx.com:ip:util_vector_logic:2.0 util_vector_logic_5
set_property -dict {CONFIG.C_SIZE 1} [get_bd_cells util_vector_logic_5]
create_bd_cell -type ip -vlnv xilinx.com:ip:xdma:4.1 xdma_0
set_property -dict [list \
  CONFIG.PF0_DEVICE_ID_mqdma 9024 \
  CONFIG.PF0_SRIOV_VF_DEVICE_ID A034 \
  CONFIG.PF2_DEVICE_ID_mqdma 9224 \
  CONFIG.PF3_DEVICE_ID_mqdma 9324 \
  CONFIG.axi_data_width 128_bit \
  CONFIG.axil_master_64bit_en false \
  CONFIG.axilite_master_en true \
  CONFIG.axist_bypass_en false \
  CONFIG.axisten_freq 125 \
  CONFIG.cfg_mgmt_if false \
  CONFIG.pf0_device_id 7024 \
  CONFIG.pl_link_cap_max_link_speed 5.0_GT/s \
  CONFIG.pl_link_cap_max_link_width X4 \
  CONFIG.plltype QPLL1 \
  CONFIG.runbit_fix false \
  CONFIG.xdma_axilite_slave false \
  CONFIG.xdma_pcie_64bit_en true \
  CONFIG.xdma_pcie_prefetchable true \
  CONFIG.xdma_rnum_chnl 2 \
  CONFIG.xdma_wnum_chnl 2 \
] [get_bd_cells xdma_0]
create_bd_cell -type ip -vlnv xilinx.com:ip:xlconstant:1.1 xlconstant_0
set_property -dict {CONFIG.CONST_VAL 0 CONFIG.CONST_WIDTH 17} [get_bd_cells xlconstant_0]
create_bd_cell -type ip -vlnv xilinx.com:ip:xlconstant:1.1 xlconstant_1
create_bd_cell -type ip -vlnv xilinx.com:ip:xlconstant:1.1 xlconstant_2
create_bd_cell -type ip -vlnv xilinx.com:ip:xlconstant:1.1 xlconstant_2_pciebusreq
set_property -dict {CONFIG.CONST_VAL 0} [get_bd_cells xlconstant_2_pciebusreq]
create_bd_cell -type ip -vlnv xilinx.com:ip:xlconstant:1.1 xlconstant_productid
set_property -dict {CONFIG.CONST_VAL 1 CONFIG.CONST_WIDTH 16} [get_bd_cells xlconstant_productid]
create_bd_cell -type ip -vlnv xilinx.com:ip:xlconstant:1.1 xlconstant_swid
set_property -dict {CONFIG.CONST_VAL 4 CONFIG.CONST_WIDTH 5} [get_bd_cells xlconstant_swid]
create_bd_cell -type ip -vlnv xilinx.com:ip:util_vector_logic:2.0 util_vector_logic_6
set_property -dict {CONFIG.C_OPERATION not CONFIG.C_SIZE 4} [get_bd_cells util_vector_logic_6]
create_bd_cell -type ip -vlnv xilinx.com:ip:c_addsub:12.0 c_addsub_0
set_property -dict [list \
  CONFIG.A_Type Unsigned \
  CONFIG.A_Width 4 \
  CONFIG.B_Constant true \
  CONFIG.B_Type Unsigned \
  CONFIG.B_Value 0000000000000010 \
  CONFIG.B_Width 16 \
  CONFIG.CE false \
  CONFIG.Latency 1 \
  CONFIG.Out_Width 16 \
] [get_bd_cells c_addsub_0]
create_bd_cell -type ip -vlnv xilinx.com:ip:xlconstant:1.1 xlconstant_majorversionid
set_property -dict {CONFIG.CONST_WIDTH 7} [get_bd_cells xlconstant_majorversionid]
create_bd_cell -type ip -vlnv xilinx.com:ip:xlconstant:1.1 xlconstant_swversion
set_property -dict {CONFIG.CONST_VAL 27 CONFIG.CONST_WIDTH 16} [get_bd_cells xlconstant_swversion]
create_bd_cell -type module -reference D_register D_register_1
set_property -dict {CONFIG.DATA_WIDTH 1} [get_bd_cells D_register_1]
create_bd_cell -type module -reference AXIL_ReadReg_64 AXIL_ReadReg_64_0
create_bd_cell -type module -reference Double_D_register Double_D_register_syncareset1
set_property -dict {CONFIG.DATA_WIDTH 1} [get_bd_cells Double_D_register_syncareset1]
create_bd_cell -type module -reference AXIL_ConfigReg_256 AXIL_ConfigReg_256_2
set_property -dict {CONFIG.INITIAL_VALUE_word_2 0} [get_bd_cells AXIL_ConfigReg_256_2]
create_bd_cell -type module -reference AXIL_ConfigReg_64 AXIL_ConfigReg_64_0
create_bd_cell -type module -reference AXI_SPI_ADC AXI_SPI_ADC_0
create_bd_cell -type module -reference D_register D_register_0
set_property -dict {CONFIG.DATA_WIDTH 5} [get_bd_cells D_register_0]
create_bd_cell -type module -reference Usr_Reg_Access Usr_Reg_Access_0
create_bd_cell -type module -reference AXIL_SPIWriter AXIL_SPIWriter_0
set_property -dict {CONFIG.SPI_CLOCK_DIVIDE 3} [get_bd_cells AXIL_SPIWriter_0]

# ---- hierarchy /RF_interfaces ----
current_bd_instance /RF_interfaces
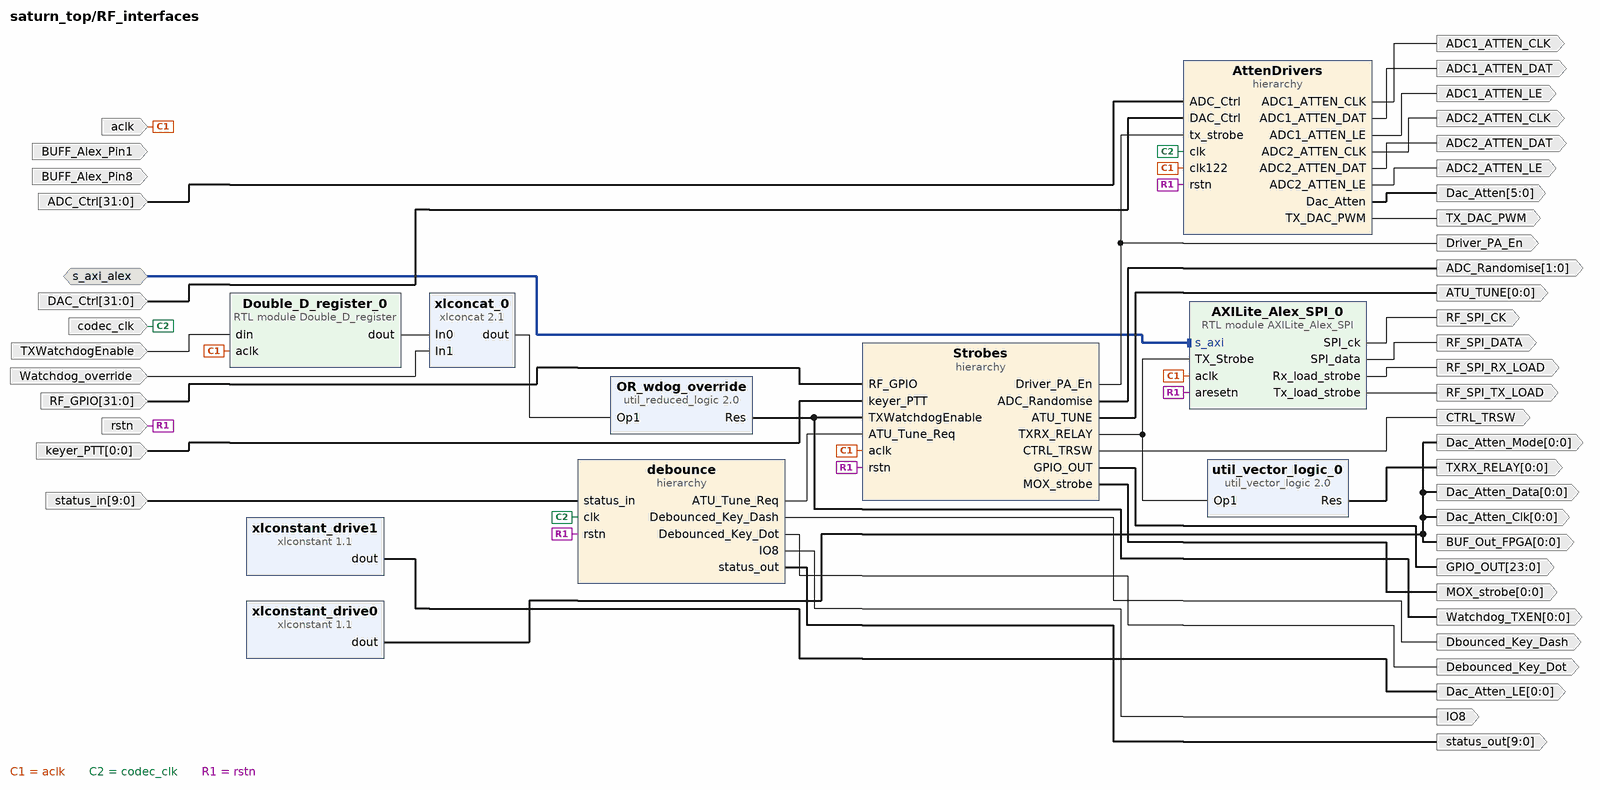
[diagram p8: block diagram inside /RF_interfaces]
create_bd_intf_pin -mode Slave -vlnv xilinx.com:interface:aximm_rtl:1.0 s_axi_alex
create_bd_pin -dir O -type clk ADC1_ATTEN_CLK
create_bd_pin -dir O ADC1_ATTEN_DAT
create_bd_pin -dir O ADC1_ATTEN_LE
create_bd_pin -dir O -type clk ADC2_ATTEN_CLK
create_bd_pin -dir O ADC2_ATTEN_DAT
create_bd_pin -dir O ADC2_ATTEN_LE
create_bd_pin -dir I -from 31 -to 0 ADC_Ctrl
create_bd_pin -dir O -from 1 -to 0 ADC_Randomise
create_bd_pin -dir O -from 0 -to 0 ATU_TUNE
create_bd_pin -dir I BUFF_Alex_Pin1
create_bd_pin -dir I BUFF_Alex_Pin8
create_bd_pin -dir O -from 0 -to 0 BUF_Out_FPGA
create_bd_pin -dir O CTRL_TRSW
create_bd_pin -dir I -from 31 -to 0 DAC_Ctrl
create_bd_pin -dir O -from 5 -to 0 Dac_Atten
create_bd_pin -dir O -from 0 -to 0 Dac_Atten_Clk
create_bd_pin -dir O -from 0 -to 0 Dac_Atten_Data
create_bd_pin -dir O -from 0 -to 0 Dac_Atten_LE
create_bd_pin -dir O -from 0 -to 0 Dac_Atten_Mode
create_bd_pin -dir O -from 23 -to 0 GPIO_OUT
create_bd_pin -dir O -from 0 -to 0 MOX_strobe
create_bd_pin -dir I -from 31 -to 0 RF_GPIO
create_bd_pin -dir O -type clk RF_SPI_CK
create_bd_pin -dir O RF_SPI_DATA
create_bd_pin -dir O RF_SPI_RX_LOAD
create_bd_pin -dir O RF_SPI_TX_LOAD
create_bd_pin -dir O -from 0 -to 0 TXRX_RELAY
create_bd_pin -dir O TX_DAC_PWM
create_bd_pin -dir I aclk
create_bd_pin -dir I -type clk codec_clk
create_bd_pin -dir I -from 0 -to 0 keyer_PTT
create_bd_pin -dir I -type rst rstn
create_bd_pin -dir I -from 9 -to 0 status_in
create_bd_pin -dir O -from 9 -to 0 status_out
create_bd_pin -dir O Dbounced_Key_Dash
create_bd_pin -dir O Debounced_Key_Dot
create_bd_pin -dir O IO8
create_bd_pin -dir O Driver_PA_En
create_bd_pin -dir I TXWatchdogEnable
create_bd_pin -dir O -from 0 -to 0 Watchdog_TXEN
create_bd_pin -dir I Watchdog_override

create_bd_cell -type hier AttenDrivers
create_bd_cell -type hier Strobes
create_bd_cell -type hier debounce
create_bd_cell -type ip -vlnv xilinx.com:ip:util_vector_logic:2.0 util_vector_logic_0
set_property -dict {CONFIG.C_OPERATION not CONFIG.C_SIZE 1} [get_bd_cells util_vector_logic_0]
create_bd_cell -type ip -vlnv xilinx.com:ip:xlconstant:1.1 xlconstant_drive0
set_property -dict {CONFIG.CONST_VAL 0} [get_bd_cells xlconstant_drive0]
create_bd_cell -type ip -vlnv xilinx.com:ip:xlconstant:1.1 xlconstant_drive1
create_bd_cell -type module -reference Double_D_register Double_D_register_0
set_property -dict {CONFIG.DATA_WIDTH 1} [get_bd_cells Double_D_register_0]
create_bd_cell -type ip -vlnv xilinx.com:ip:util_reduced_logic:2.0 OR_wdog_override
set_property -dict {CONFIG.C_OPERATION or CONFIG.C_SIZE 2} [get_bd_cells OR_wdog_override]
create_bd_cell -type ip -vlnv xilinx.com:ip:xlconcat:2.1 xlconcat_0
create_bd_cell -type module -reference AXILite_Alex_SPI AXILite_Alex_SPI_0

# ---- hierarchy /RF_interfaces/AttenDrivers ----
current_bd_instance /RF_interfaces/AttenDrivers
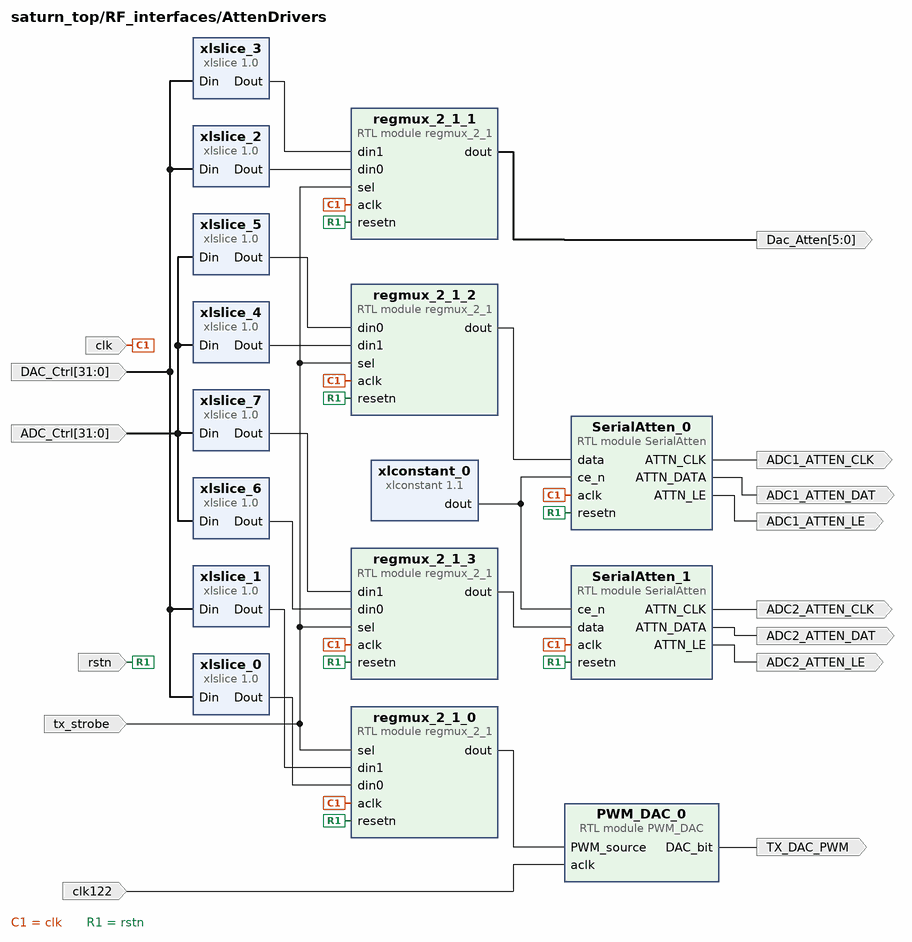
[diagram p9: block diagram inside /RF_interfaces/AttenDrivers]
create_bd_pin -dir O -type clk ADC1_ATTEN_CLK
create_bd_pin -dir O ADC1_ATTEN_DAT
create_bd_pin -dir O ADC1_ATTEN_LE
create_bd_pin -dir O -type clk ADC2_ATTEN_CLK
create_bd_pin -dir O ADC2_ATTEN_DAT
create_bd_pin -dir O ADC2_ATTEN_LE
create_bd_pin -dir I -from 31 -to 0 ADC_Ctrl
create_bd_pin -dir I -from 31 -to 0 DAC_Ctrl
create_bd_pin -dir O -from 5 -to 0 Dac_Atten
create_bd_pin -dir O TX_DAC_PWM
create_bd_pin -dir I -type clk clk
create_bd_pin -dir I -type rst rstn
create_bd_pin -dir I tx_strobe
create_bd_pin -dir I clk122

create_bd_cell -type ip -vlnv xilinx.com:ip:xlslice:1.0 xlslice_0
set_property -dict {CONFIG.DIN_FROM 7 CONFIG.DOUT_WIDTH 8} [get_bd_cells xlslice_0]
create_bd_cell -type ip -vlnv xilinx.com:ip:xlslice:1.0 xlslice_1
set_property -dict {CONFIG.DIN_FROM 15 CONFIG.DIN_TO 8 CONFIG.DOUT_WIDTH 8} [get_bd_cells xlslice_1]
create_bd_cell -type ip -vlnv xilinx.com:ip:xlslice:1.0 xlslice_2
set_property -dict {CONFIG.DIN_FROM 21 CONFIG.DIN_TO 16 CONFIG.DOUT_WIDTH 6} [get_bd_cells xlslice_2]
create_bd_cell -type ip -vlnv xilinx.com:ip:xlslice:1.0 xlslice_3
set_property -dict {CONFIG.DIN_FROM 29 CONFIG.DIN_TO 24 CONFIG.DOUT_WIDTH 6} [get_bd_cells xlslice_3]
create_bd_cell -type ip -vlnv xilinx.com:ip:xlslice:1.0 xlslice_4
set_property -dict {CONFIG.DIN_FROM 9 CONFIG.DIN_TO 5 CONFIG.DIN_WIDTH 32 CONFIG.DOUT_WIDTH 5} [get_bd_cells xlslice_4]
create_bd_cell -type ip -vlnv xilinx.com:ip:xlslice:1.0 xlslice_5
set_property -dict {CONFIG.DIN_FROM 4 CONFIG.DIN_TO 0 CONFIG.DIN_WIDTH 32 CONFIG.DOUT_WIDTH 5} [get_bd_cells xlslice_5]
create_bd_cell -type ip -vlnv xilinx.com:ip:xlslice:1.0 xlslice_6
set_property -dict {CONFIG.DIN_FROM 14 CONFIG.DIN_TO 10 CONFIG.DIN_WIDTH 32 CONFIG.DOUT_WIDTH 5} [get_bd_cells xlslice_6]
create_bd_cell -type ip -vlnv xilinx.com:ip:xlslice:1.0 xlslice_7
set_property -dict {CONFIG.DIN_FROM 19 CONFIG.DIN_TO 15 CONFIG.DIN_WIDTH 32 CONFIG.DOUT_WIDTH 5} [get_bd_cells xlslice_7]
create_bd_cell -type module -reference SerialAtten SerialAtten_1
create_bd_cell -type ip -vlnv xilinx.com:ip:xlconstant:1.1 xlconstant_0
set_property -dict {CONFIG.CONST_VAL 0} [get_bd_cells xlconstant_0]
create_bd_cell -type module -reference regmux_2_1 regmux_2_1_1
set_property -dict {CONFIG.DATA_WIDTH 6} [get_bd_cells regmux_2_1_1]
create_bd_cell -type module -reference regmux_2_1 regmux_2_1_2
set_property -dict {CONFIG.DATA_WIDTH 5} [get_bd_cells regmux_2_1_2]
create_bd_cell -type module -reference regmux_2_1 regmux_2_1_3
set_property -dict {CONFIG.DATA_WIDTH 5} [get_bd_cells regmux_2_1_3]
create_bd_cell -type module -reference SerialAtten SerialAtten_0
create_bd_cell -type module -reference PWM_DAC PWM_DAC_0
create_bd_cell -type module -reference regmux_2_1 regmux_2_1_0
set_property -dict {CONFIG.DATA_WIDTH 8} [get_bd_cells regmux_2_1_0]

# ---- hierarchy /RF_interfaces/Strobes ----
current_bd_instance /RF_interfaces/Strobes
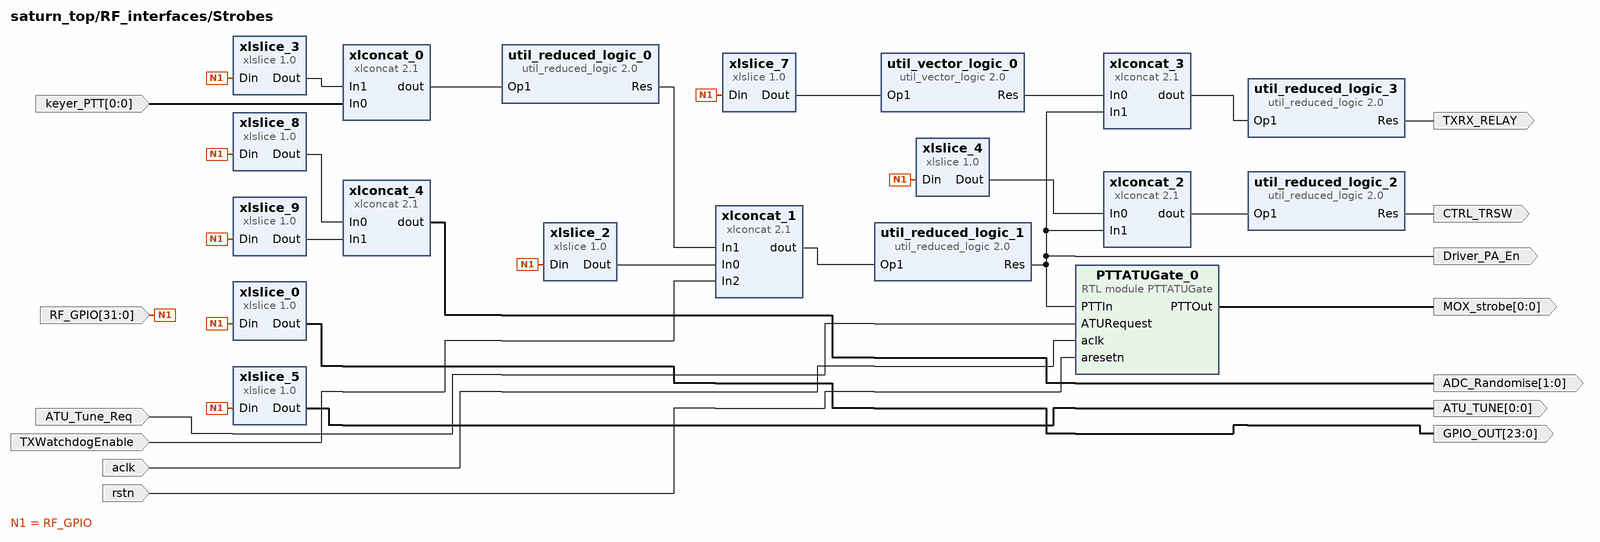
[diagram p10: block diagram inside /RF_interfaces/Strobes]
create_bd_pin -dir O -from 1 -to 0 ADC_Randomise
create_bd_pin -dir O -from 0 -to 0 ATU_TUNE
create_bd_pin -dir O CTRL_TRSW
create_bd_pin -dir O -from 23 -to 0 GPIO_OUT
create_bd_pin -dir O -from 0 -to 0 MOX_strobe
create_bd_pin -dir I -from 31 -to 0 RF_GPIO
create_bd_pin -dir O TXRX_RELAY
create_bd_pin -dir I -from 0 -to 0 keyer_PTT
create_bd_pin -dir O Driver_PA_En
create_bd_pin -dir I ATU_Tune_Req
create_bd_pin -dir I aclk
create_bd_pin -dir I rstn
create_bd_pin -dir I TXWatchdogEnable

create_bd_cell -type ip -vlnv xilinx.com:ip:util_reduced_logic:2.0 util_reduced_logic_0
set_property -dict {CONFIG.C_OPERATION or CONFIG.C_SIZE 2} [get_bd_cells util_reduced_logic_0]
create_bd_cell -type ip -vlnv xilinx.com:ip:util_reduced_logic:2.0 util_reduced_logic_1
set_property -dict {CONFIG.C_SIZE 3} [get_bd_cells util_reduced_logic_1]
create_bd_cell -type ip -vlnv xilinx.com:ip:util_reduced_logic:2.0 util_reduced_logic_2
set_property -dict {CONFIG.C_SIZE 2} [get_bd_cells util_reduced_logic_2]
create_bd_cell -type ip -vlnv xilinx.com:ip:util_reduced_logic:2.0 util_reduced_logic_3
set_property -dict {CONFIG.C_OPERATION and CONFIG.C_SIZE 2} [get_bd_cells util_reduced_logic_3]
create_bd_cell -type ip -vlnv xilinx.com:ip:xlconcat:2.1 xlconcat_0
set_property -dict {CONFIG.IN0_WIDTH 1 CONFIG.IN1_WIDTH 1} [get_bd_cells xlconcat_0]
create_bd_cell -type ip -vlnv xilinx.com:ip:xlconcat:2.1 xlconcat_1
set_property -dict {CONFIG.IN0_WIDTH 1 CONFIG.IN1_WIDTH 1 CONFIG.NUM_PORTS 3} [get_bd_cells xlconcat_1]
create_bd_cell -type ip -vlnv xilinx.com:ip:xlconcat:2.1 xlconcat_2
set_property -dict {CONFIG.IN0_WIDTH 1 CONFIG.IN1_WIDTH 1} [get_bd_cells xlconcat_2]
create_bd_cell -type ip -vlnv xilinx.com:ip:xlconcat:2.1 xlconcat_3
set_property -dict {CONFIG.IN0_WIDTH 1 CONFIG.IN1_WIDTH 1} [get_bd_cells xlconcat_3]
create_bd_cell -type ip -vlnv xilinx.com:ip:xlconcat:2.1 xlconcat_4
create_bd_cell -type ip -vlnv xilinx.com:ip:xlslice:1.0 xlslice_0
set_property -dict {CONFIG.DIN_FROM 23 CONFIG.DOUT_WIDTH 24} [get_bd_cells xlslice_0]
create_bd_cell -type ip -vlnv xilinx.com:ip:xlslice:1.0 xlslice_2
set_property -dict {CONFIG.DIN_FROM 25 CONFIG.DIN_TO 25 CONFIG.DOUT_WIDTH 1} [get_bd_cells xlslice_2]
create_bd_cell -type ip -vlnv xilinx.com:ip:xlslice:1.0 xlslice_3
set_property -dict {CONFIG.DIN_FROM 24 CONFIG.DIN_TO 24 CONFIG.DOUT_WIDTH 1} [get_bd_cells xlslice_3]
create_bd_cell -type ip -vlnv xilinx.com:ip:xlslice:1.0 xlslice_4
set_property -dict {CONFIG.DIN_FROM 30 CONFIG.DIN_TO 30 CONFIG.DOUT_WIDTH 1} [get_bd_cells xlslice_4]
create_bd_cell -type ip -vlnv xilinx.com:ip:xlslice:1.0 xlslice_5
set_property -dict {CONFIG.DIN_FROM 29 CONFIG.DIN_TO 29 CONFIG.DOUT_WIDTH 1} [get_bd_cells xlslice_5]
create_bd_cell -type ip -vlnv xilinx.com:ip:xlslice:1.0 xlslice_7
set_property -dict {CONFIG.DIN_FROM 27 CONFIG.DIN_TO 27 CONFIG.DOUT_WIDTH 1} [get_bd_cells xlslice_7]
create_bd_cell -type ip -vlnv xilinx.com:ip:xlslice:1.0 xlslice_8
set_property -dict {CONFIG.DIN_FROM 8 CONFIG.DIN_TO 8 CONFIG.DOUT_WIDTH 1} [get_bd_cells xlslice_8]
create_bd_cell -type ip -vlnv xilinx.com:ip:xlslice:1.0 xlslice_9
set_property -dict {CONFIG.DIN_FROM 11 CONFIG.DIN_TO 11 CONFIG.DOUT_WIDTH 1} [get_bd_cells xlslice_9]
create_bd_cell -type ip -vlnv xilinx.com:ip:util_vector_logic:2.0 util_vector_logic_0
set_property -dict {CONFIG.C_OPERATION not CONFIG.C_SIZE 1} [get_bd_cells util_vector_logic_0]
create_bd_cell -type module -reference PTTATUGate PTTATUGate_0

# ---- hierarchy /RF_interfaces/debounce ----
current_bd_instance /RF_interfaces/debounce
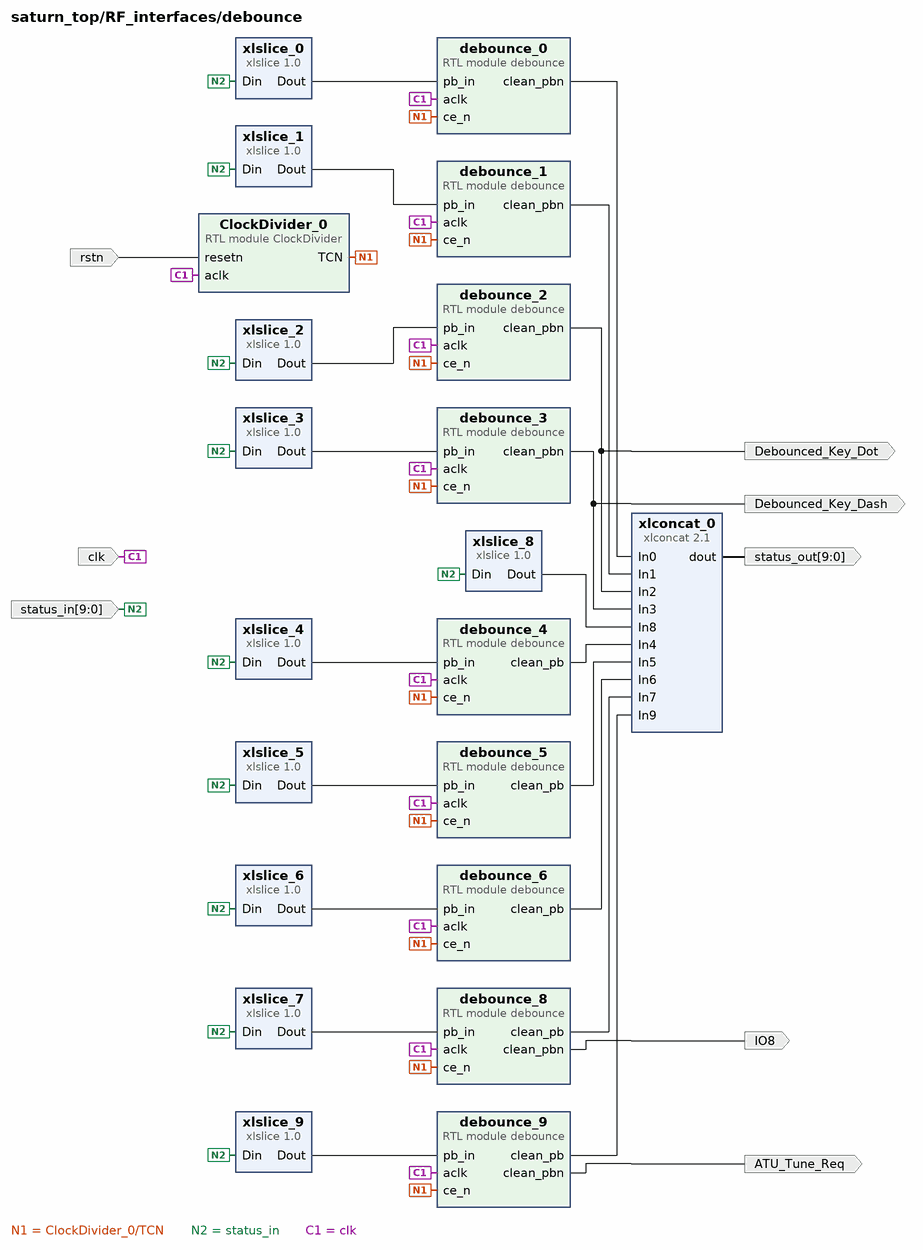
[diagram p11: block diagram inside /RF_interfaces/debounce]
create_bd_pin -dir I -type clk clk
create_bd_pin -dir I -type rst rstn
create_bd_pin -dir I -from 9 -to 0 status_in
create_bd_pin -dir O -from 9 -to 0 status_out
create_bd_pin -dir O Debounced_Key_Dot
create_bd_pin -dir O Debounced_Key_Dash
create_bd_pin -dir O IO8
create_bd_pin -dir O ATU_Tune_Req

create_bd_cell -type ip -vlnv xilinx.com:ip:xlconcat:2.1 xlconcat_0
set_property -dict {CONFIG.NUM_PORTS 10} [get_bd_cells xlconcat_0]
create_bd_cell -type ip -vlnv xilinx.com:ip:xlslice:1.0 xlslice_0
set_property -dict {CONFIG.DIN_FROM 0 CONFIG.DIN_TO 0 CONFIG.DIN_WIDTH 10} [get_bd_cells xlslice_0]
create_bd_cell -type ip -vlnv xilinx.com:ip:xlslice:1.0 xlslice_1
set_property -dict {CONFIG.DIN_FROM 1 CONFIG.DIN_TO 1 CONFIG.DIN_WIDTH 10 CONFIG.DOUT_WIDTH 1} [get_bd_cells xlslice_1]
create_bd_cell -type ip -vlnv xilinx.com:ip:xlslice:1.0 xlslice_2
set_property -dict {CONFIG.DIN_FROM 2 CONFIG.DIN_TO 2 CONFIG.DIN_WIDTH 10 CONFIG.DOUT_WIDTH 1} [get_bd_cells xlslice_2]
create_bd_cell -type ip -vlnv xilinx.com:ip:xlslice:1.0 xlslice_3
set_property -dict {CONFIG.DIN_FROM 3 CONFIG.DIN_TO 3 CONFIG.DIN_WIDTH 10 CONFIG.DOUT_WIDTH 1} [get_bd_cells xlslice_3]
create_bd_cell -type ip -vlnv xilinx.com:ip:xlslice:1.0 xlslice_4
set_property -dict {CONFIG.DIN_FROM 4 CONFIG.DIN_TO 4 CONFIG.DIN_WIDTH 10 CONFIG.DOUT_WIDTH 1} [get_bd_cells xlslice_4]
create_bd_cell -type ip -vlnv xilinx.com:ip:xlslice:1.0 xlslice_5
set_property -dict {CONFIG.DIN_FROM 5 CONFIG.DIN_TO 5 CONFIG.DIN_WIDTH 10 CONFIG.DOUT_WIDTH 1} [get_bd_cells xlslice_5]
create_bd_cell -type ip -vlnv xilinx.com:ip:xlslice:1.0 xlslice_6
set_property -dict {CONFIG.DIN_FROM 6 CONFIG.DIN_TO 6 CONFIG.DIN_WIDTH 10 CONFIG.DOUT_WIDTH 1} [get_bd_cells xlslice_6]
create_bd_cell -type ip -vlnv xilinx.com:ip:xlslice:1.0 xlslice_7
set_property -dict {CONFIG.DIN_FROM 7 CONFIG.DIN_TO 7 CONFIG.DIN_WIDTH 10 CONFIG.DOUT_WIDTH 1} [get_bd_cells xlslice_7]
create_bd_cell -type ip -vlnv xilinx.com:ip:xlslice:1.0 xlslice_8
set_property -dict {CONFIG.DIN_FROM 8 CONFIG.DIN_TO 8 CONFIG.DIN_WIDTH 10 CONFIG.DOUT_WIDTH 1} [get_bd_cells xlslice_8]
create_bd_cell -type module -reference debounce debounce_1
set_property -dict {CONFIG.debounce_count 10} [get_bd_cells debounce_1]
create_bd_cell -type module -reference debounce debounce_2
set_property -dict {CONFIG.debounce_count 10} [get_bd_cells debounce_2]
create_bd_cell -type module -reference debounce debounce_3
set_property -dict {CONFIG.debounce_count 10} [get_bd_cells debounce_3]
create_bd_cell -type module -reference debounce debounce_4
set_property -dict {CONFIG.debounce_count 10} [get_bd_cells debounce_4]
create_bd_cell -type module -reference debounce debounce_5
set_property -dict {CONFIG.debounce_count 10} [get_bd_cells debounce_5]
create_bd_cell -type module -reference debounce debounce_6
set_property -dict {CONFIG.debounce_count 10} [get_bd_cells debounce_6]
create_bd_cell -type module -reference debounce debounce_8
set_property -dict {CONFIG.debounce_count 10} [get_bd_cells debounce_8]
create_bd_cell -type module -reference debounce debounce_9
set_property -dict {CONFIG.debounce_count 10} [get_bd_cells debounce_9]
create_bd_cell -type ip -vlnv xilinx.com:ip:xlslice:1.0 xlslice_9
set_property -dict {CONFIG.DIN_FROM 9 CONFIG.DIN_TO 9 CONFIG.DIN_WIDTH 10} [get_bd_cells xlslice_9]
create_bd_cell -type module -reference ClockDivider ClockDivider_0
set_property -dict {CONFIG.Divisor 12000} [get_bd_cells ClockDivider_0]
create_bd_cell -type module -reference debounce debounce_0
set_property -dict {CONFIG.debounce_count 10} [get_bd_cells debounce_0]

# ---- hierarchy /Receiver ----
current_bd_instance /Receiver
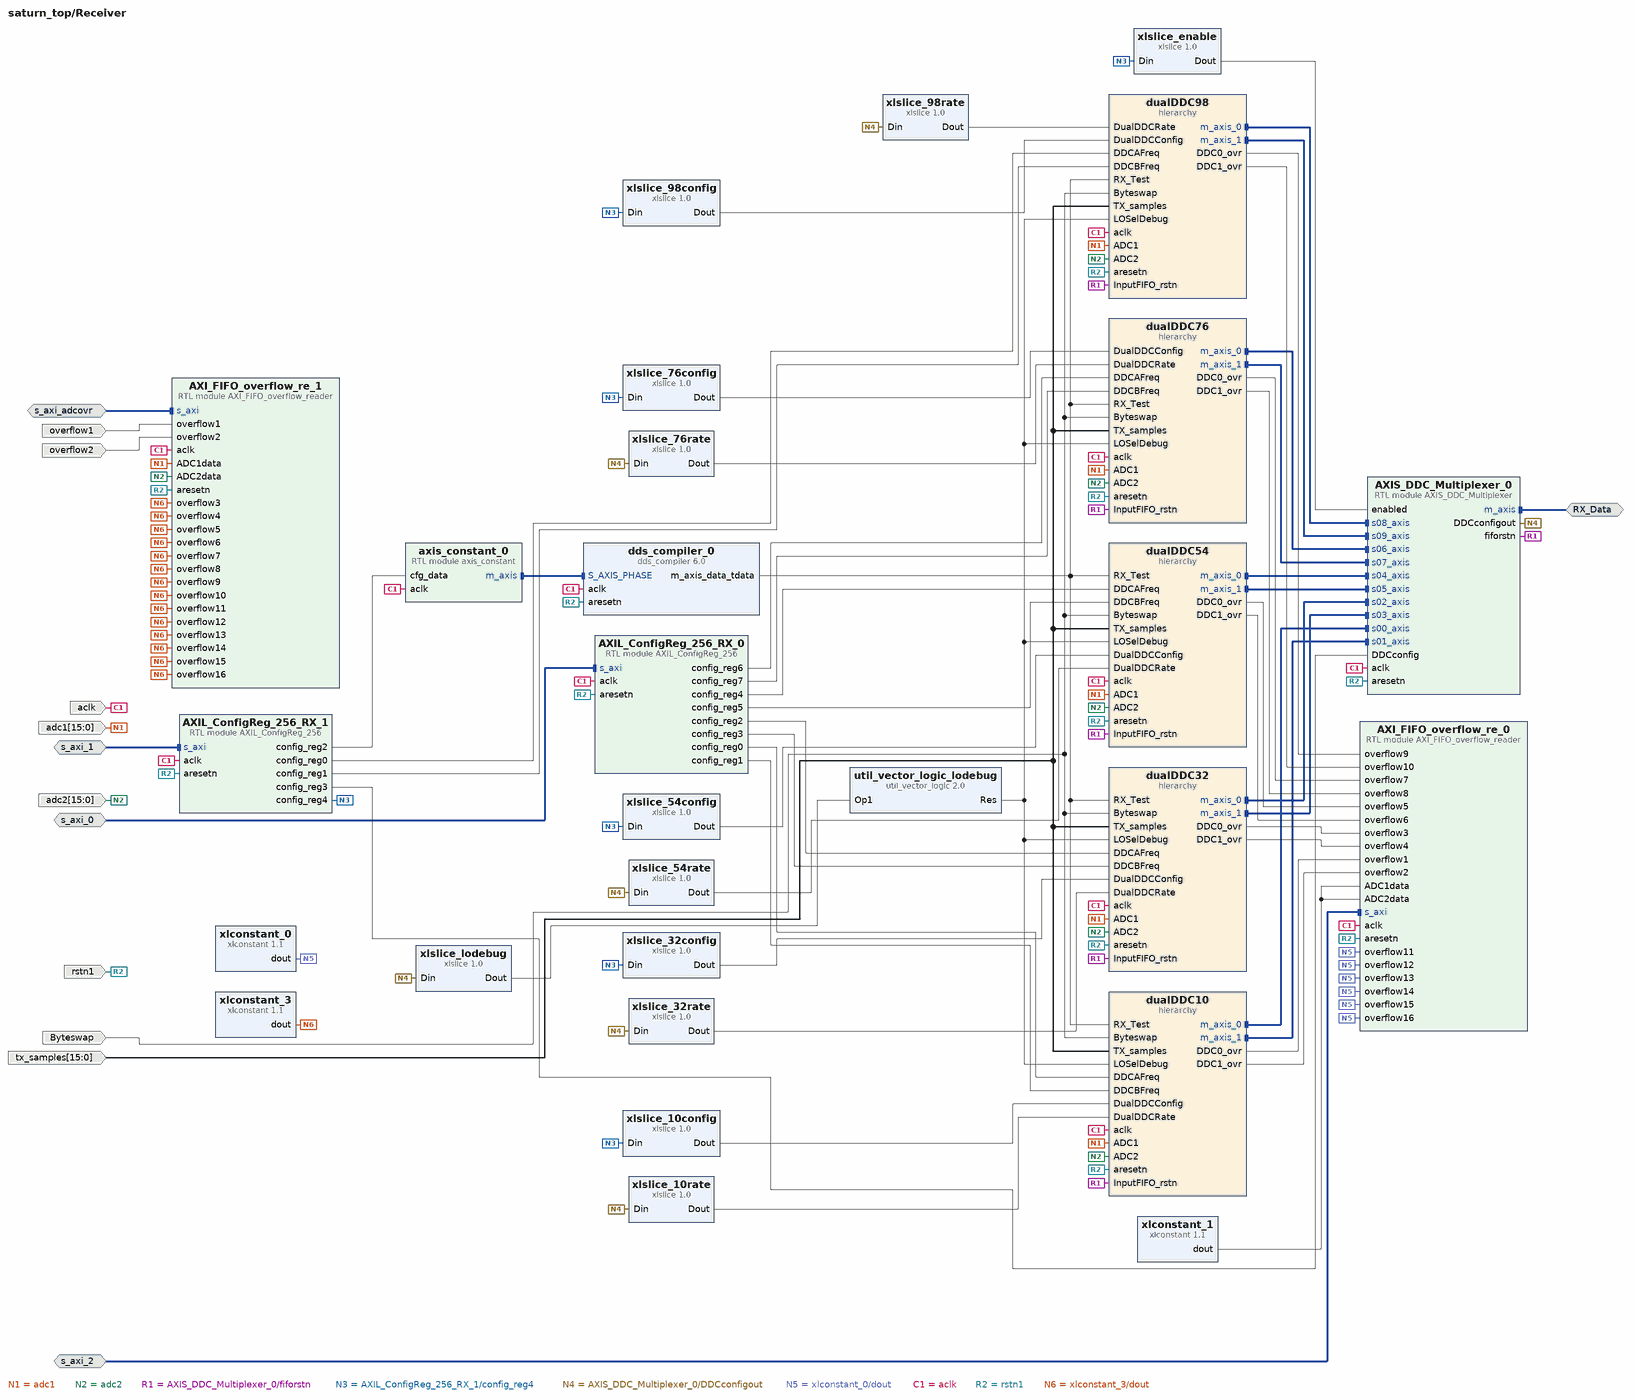
[diagram p12: block diagram inside /Receiver]
create_bd_intf_pin -mode Slave -vlnv xilinx.com:interface:aximm_rtl:1.0 s_axi_0
create_bd_intf_pin -mode Slave -vlnv xilinx.com:interface:aximm_rtl:1.0 s_axi_1
create_bd_intf_pin -mode Master -vlnv xilinx.com:interface:axis_rtl:1.0 RX_Data
create_bd_intf_pin -mode Slave -vlnv xilinx.com:interface:aximm_rtl:1.0 s_axi_2
create_bd_intf_pin -mode Slave -vlnv xilinx.com:interface:aximm_rtl:1.0 s_axi_adcovr
create_bd_pin -dir I -type clk aclk
create_bd_pin -dir I -from 15 -to 0 adc1
create_bd_pin -dir I -from 15 -to 0 adc2
create_bd_pin -dir I -type rst rstn1
create_bd_pin -dir I -from 15 -to 0 tx_samples
create_bd_pin -dir I Byteswap
create_bd_pin -dir I overflow1
create_bd_pin -dir I overflow2

create_bd_cell -type hier dualDDC10
create_bd_cell -type module -reference AXIL_ConfigReg_256 AXIL_ConfigReg_256_RX_0
set_property -dict {CONFIG.INITIAL_VALUE_word_2 0 CONFIG.INITIAL_VALUE_word_5 0} [get_bd_cells AXIL_ConfigReg_256_RX_0]
create_bd_cell -type module -reference AXIL_ConfigReg_256 AXIL_ConfigReg_256_RX_1
set_property -dict [list \
  CONFIG.INITIAL_VALUE_word_0 0 \
  CONFIG.INITIAL_VALUE_word_3 0 \
  CONFIG.INITIAL_VALUE_word_6 0 \
] [get_bd_cells AXIL_ConfigReg_256_RX_1]
create_bd_cell -type hier dualDDC98
create_bd_cell -type hier dualDDC32
create_bd_cell -type hier dualDDC54
create_bd_cell -type hier dualDDC76
create_bd_cell -type ip -vlnv xilinx.com:ip:xlslice:1.0 xlslice_10config
set_property -dict {CONFIG.DIN_FROM 3 CONFIG.DOUT_WIDTH 4} [get_bd_cells xlslice_10config]
create_bd_cell -type ip -vlnv xilinx.com:ip:xlslice:1.0 xlslice_32config
set_property -dict {CONFIG.DIN_FROM 7 CONFIG.DIN_TO 4 CONFIG.DOUT_WIDTH 4} [get_bd_cells xlslice_32config]
create_bd_cell -type ip -vlnv xilinx.com:ip:xlslice:1.0 xlslice_54config
set_property -dict {CONFIG.DIN_FROM 11 CONFIG.DIN_TO 8 CONFIG.DOUT_WIDTH 4} [get_bd_cells xlslice_54config]
create_bd_cell -type ip -vlnv xilinx.com:ip:xlslice:1.0 xlslice_76config
set_property -dict {CONFIG.DIN_FROM 15 CONFIG.DIN_TO 12 CONFIG.DOUT_WIDTH 4} [get_bd_cells xlslice_76config]
create_bd_cell -type ip -vlnv xilinx.com:ip:xlslice:1.0 xlslice_98config
set_property -dict {CONFIG.DIN_FROM 19 CONFIG.DIN_TO 16 CONFIG.DOUT_WIDTH 4} [get_bd_cells xlslice_98config]
create_bd_cell -type ip -vlnv xilinx.com:ip:xlslice:1.0 xlslice_10rate
set_property -dict {CONFIG.DIN_FROM 5 CONFIG.DOUT_WIDTH 6} [get_bd_cells xlslice_10rate]
create_bd_cell -type ip -vlnv xilinx.com:ip:xlslice:1.0 xlslice_32rate
set_property -dict {CONFIG.DIN_FROM 11 CONFIG.DIN_TO 6 CONFIG.DOUT_WIDTH 6} [get_bd_cells xlslice_32rate]
create_bd_cell -type ip -vlnv xilinx.com:ip:xlslice:1.0 xlslice_54rate
set_property -dict {CONFIG.DIN_FROM 17 CONFIG.DIN_TO 12 CONFIG.DOUT_WIDTH 6} [get_bd_cells xlslice_54rate]
create_bd_cell -type ip -vlnv xilinx.com:ip:xlslice:1.0 xlslice_76rate
set_property -dict {CONFIG.DIN_FROM 23 CONFIG.DIN_TO 18 CONFIG.DOUT_WIDTH 6} [get_bd_cells xlslice_76rate]
create_bd_cell -type ip -vlnv xilinx.com:ip:xlslice:1.0 xlslice_98rate
set_property -dict {CONFIG.DIN_FROM 29 CONFIG.DIN_TO 24 CONFIG.DOUT_WIDTH 6} [get_bd_cells xlslice_98rate]
create_bd_cell -type ip -vlnv xilinx.com:ip:xlslice:1.0 xlslice_enable
set_property -dict {CONFIG.DIN_FROM 30 CONFIG.DIN_TO 30 CONFIG.DOUT_WIDTH 1} [get_bd_cells xlslice_enable]
create_bd_cell -type ip -vlnv xilinx.com:ip:dds_compiler:6.0 dds_compiler_0
set_property -dict [list \
  CONFIG.Amplitude_Mode Unit_Circle \
  CONFIG.DATA_Has_TLAST Not_Required \
  CONFIG.DDS_Clock_Rate 122.88 \
  CONFIG.Frequency_Resolution 0.05 \
  CONFIG.Has_ACLKEN false \
  CONFIG.Has_ARESETn true \
  CONFIG.Has_Phase_Out false \
  CONFIG.Latency 8 \
  CONFIG.M_DATA_Has_TUSER Not_Required \
  CONFIG.Noise_Shaping Auto \
  CONFIG.Output_Frequency1 0 \
  CONFIG.Output_Selection Sine \
  CONFIG.Output_Width 16 \
  CONFIG.PINC1 0 \
  CONFIG.Phase_Increment Streaming \
  CONFIG.Phase_Width 32 \
  CONFIG.S_PHASE_Has_TUSER Not_Required \
  CONFIG.Spurious_Free_Dynamic_Range 94 \
] [get_bd_cells dds_compiler_0]
create_bd_cell -type ip -vlnv xilinx.com:ip:xlconstant:1.1 xlconstant_0
set_property -dict {CONFIG.CONST_VAL 0} [get_bd_cells xlconstant_0]
create_bd_cell -type module -reference axis_constant axis_constant_0
create_bd_cell -type module -reference AXIS_DDC_Multiplexer AXIS_DDC_Multiplexer_0
create_bd_cell -type ip -vlnv xilinx.com:ip:xlslice:1.0 xlslice_lodebug
set_property -dict {CONFIG.DIN_FROM 30 CONFIG.DIN_TO 30} [get_bd_cells xlslice_lodebug]
create_bd_cell -type ip -vlnv xilinx.com:ip:util_vector_logic:2.0 util_vector_logic_lodebug
set_property -dict {CONFIG.C_OPERATION not CONFIG.C_SIZE 1} [get_bd_cells util_vector_logic_lodebug]
create_bd_cell -type ip -vlnv xilinx.com:ip:xlconstant:1.1 xlconstant_3
set_property -dict {CONFIG.CONST_VAL 0} [get_bd_cells xlconstant_3]
create_bd_cell -type module -reference AXI_FIFO_overflow_reader AXI_FIFO_overflow_re_0
create_bd_cell -type module -reference AXI_FIFO_overflow_reader AXI_FIFO_overflow_re_1
create_bd_cell -type ip -vlnv xilinx.com:ip:xlconstant:1.1 xlconstant_1
set_property -dict {CONFIG.CONST_VAL 0 CONFIG.CONST_WIDTH 16} [get_bd_cells xlconstant_1]
